# EAGLE design 612_jetracer_328_214 (EAGLE 9.6.2)
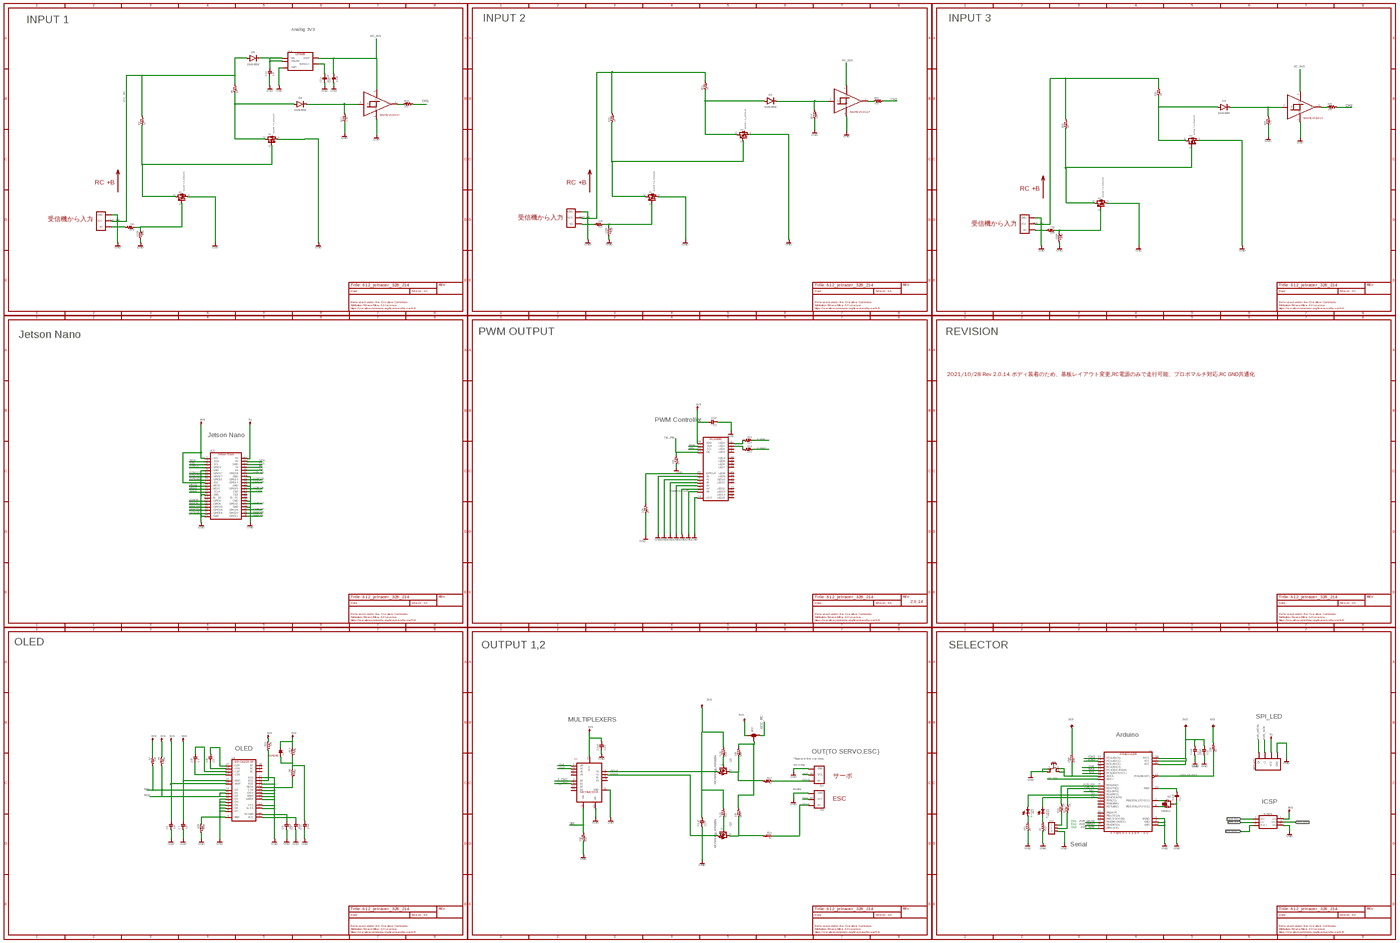
[diagram p0: schematic, sheet 1, overview]
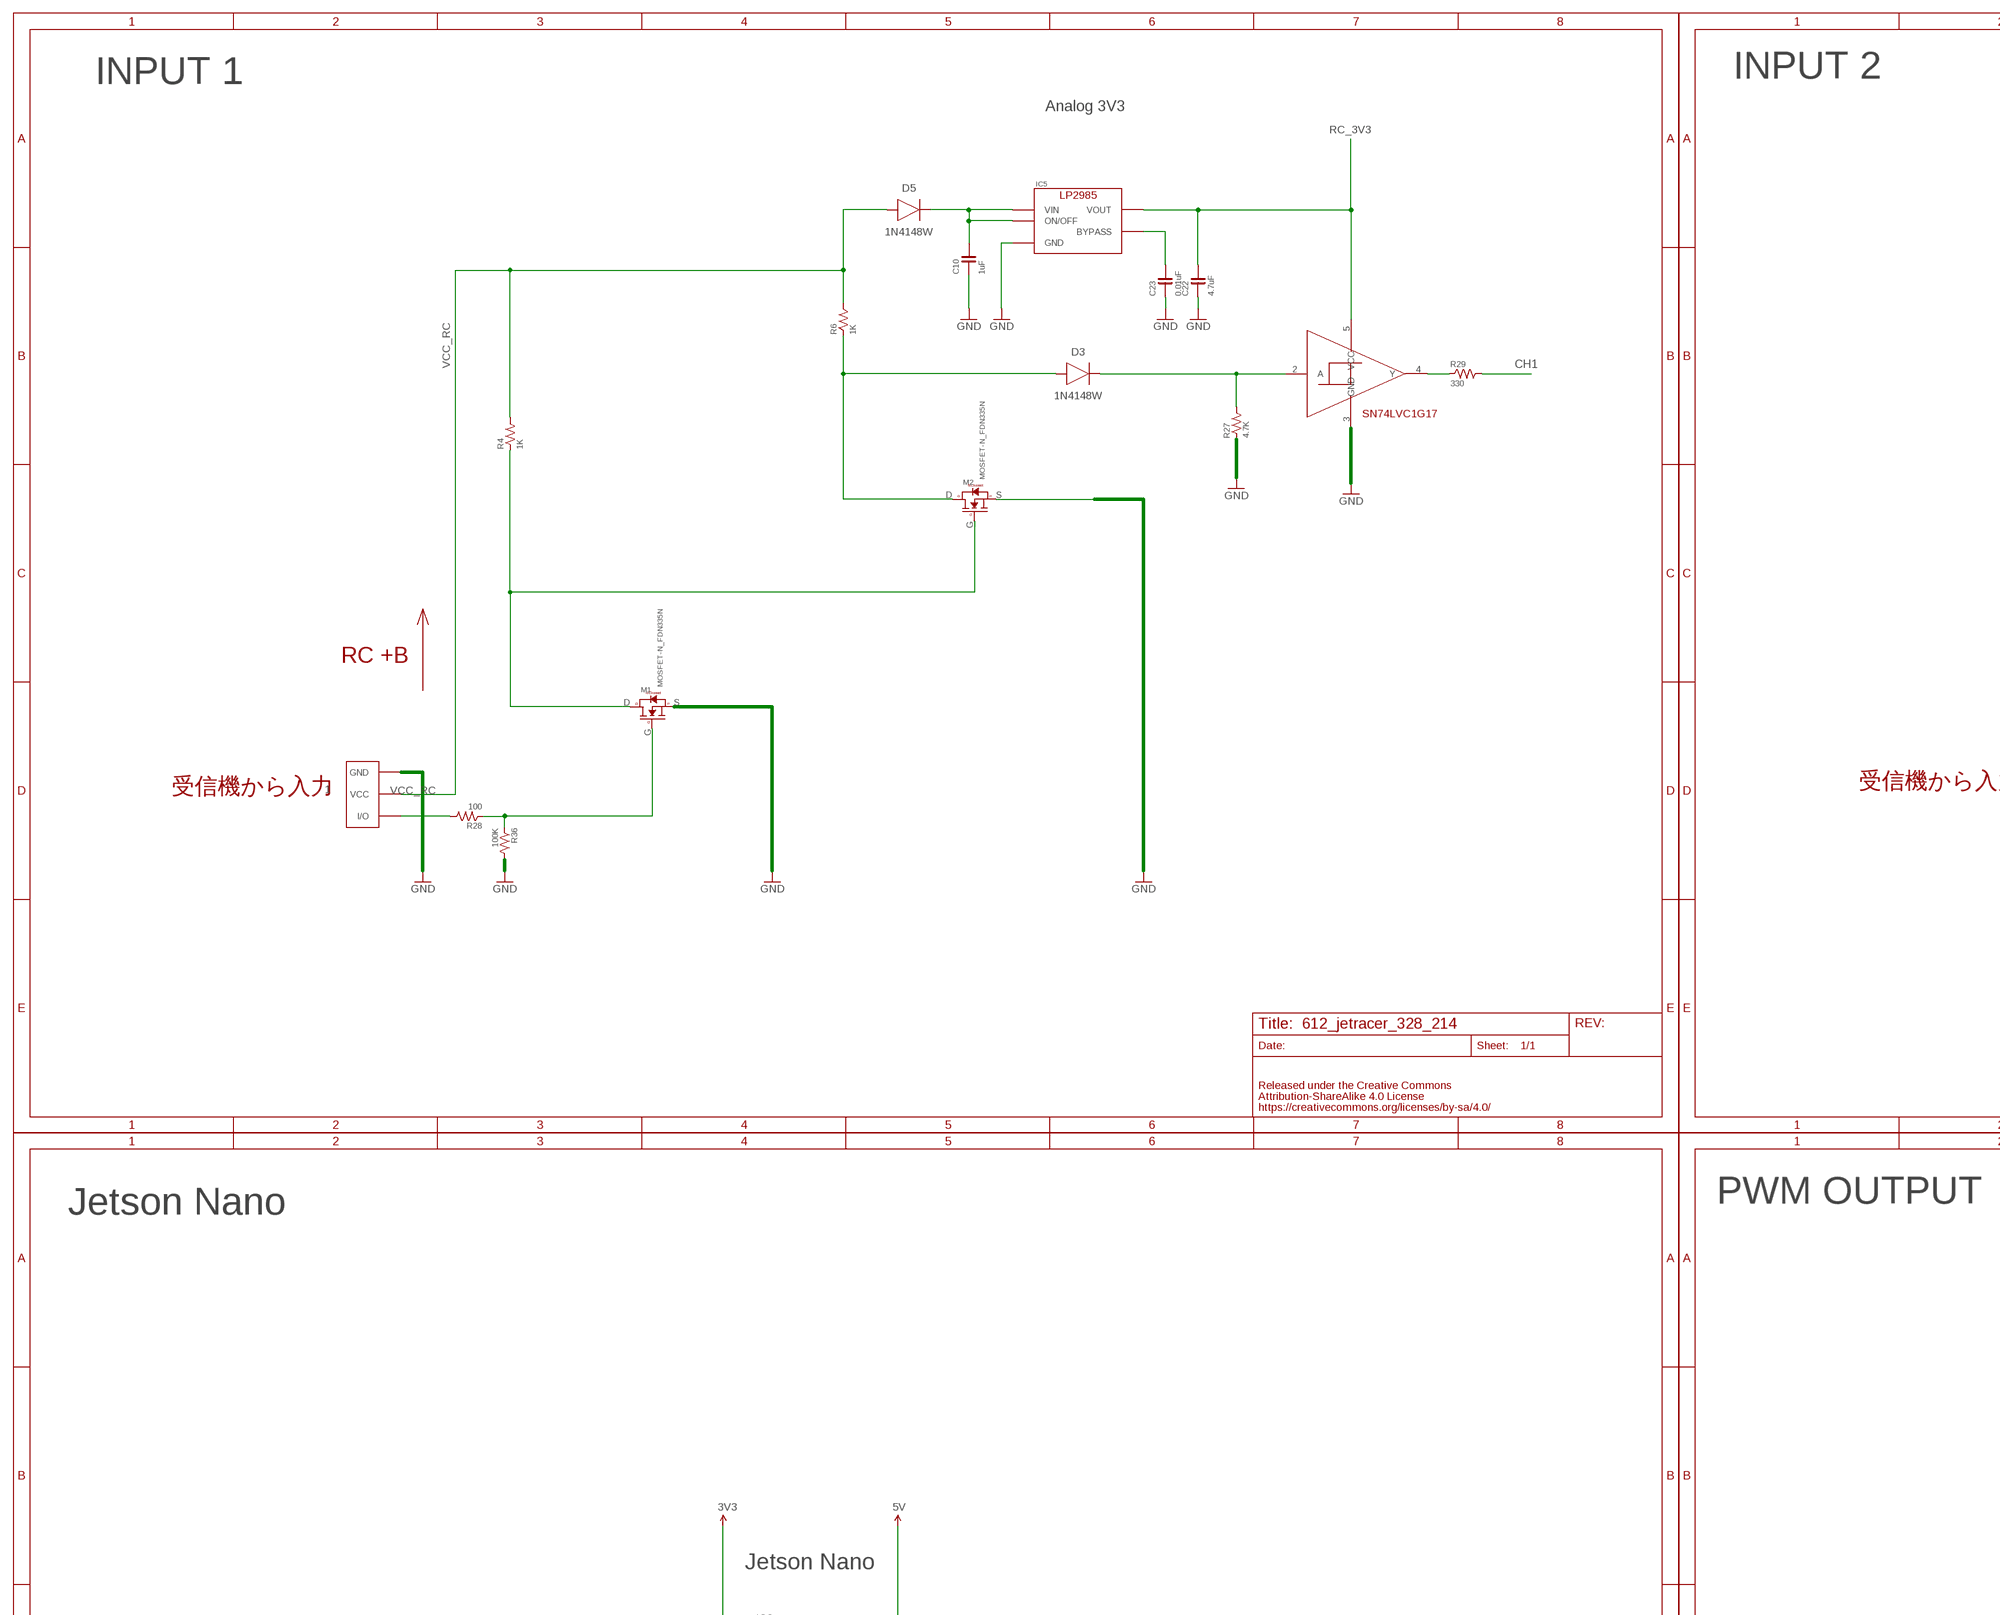
[diagram p1: schematic, sheet 1, part 1 of 6]
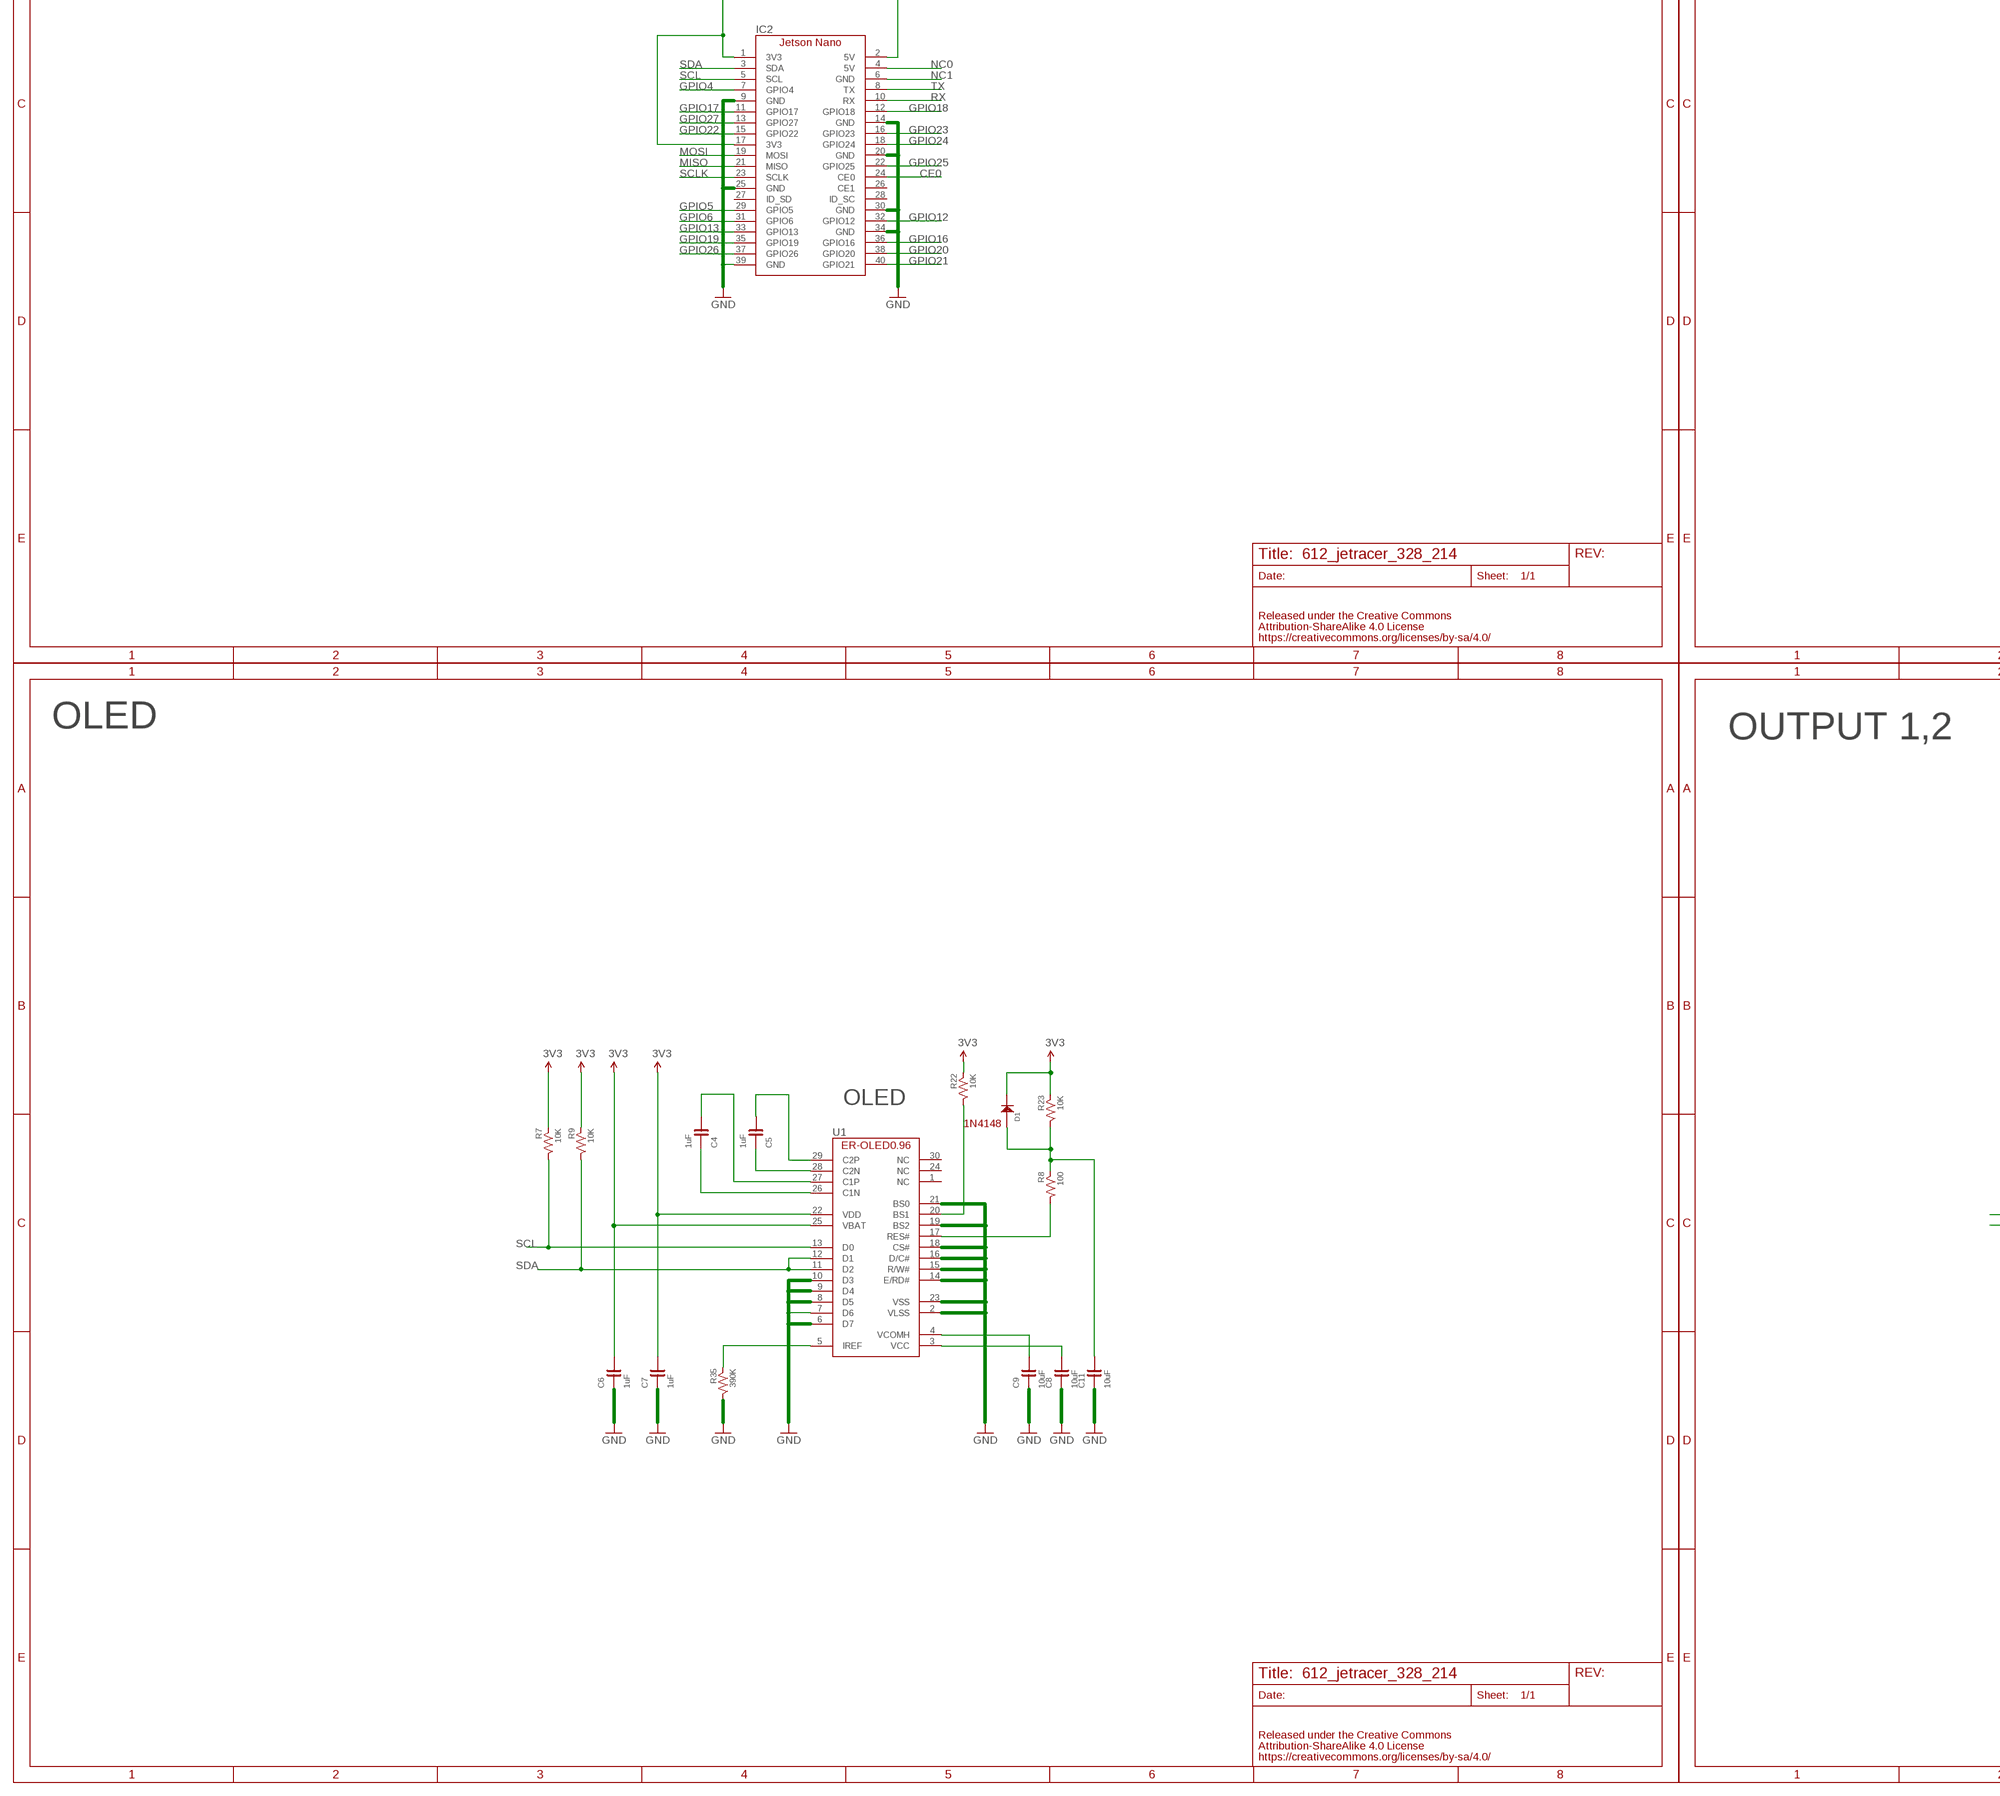
[diagram p2: schematic, sheet 1, part 2 of 6]
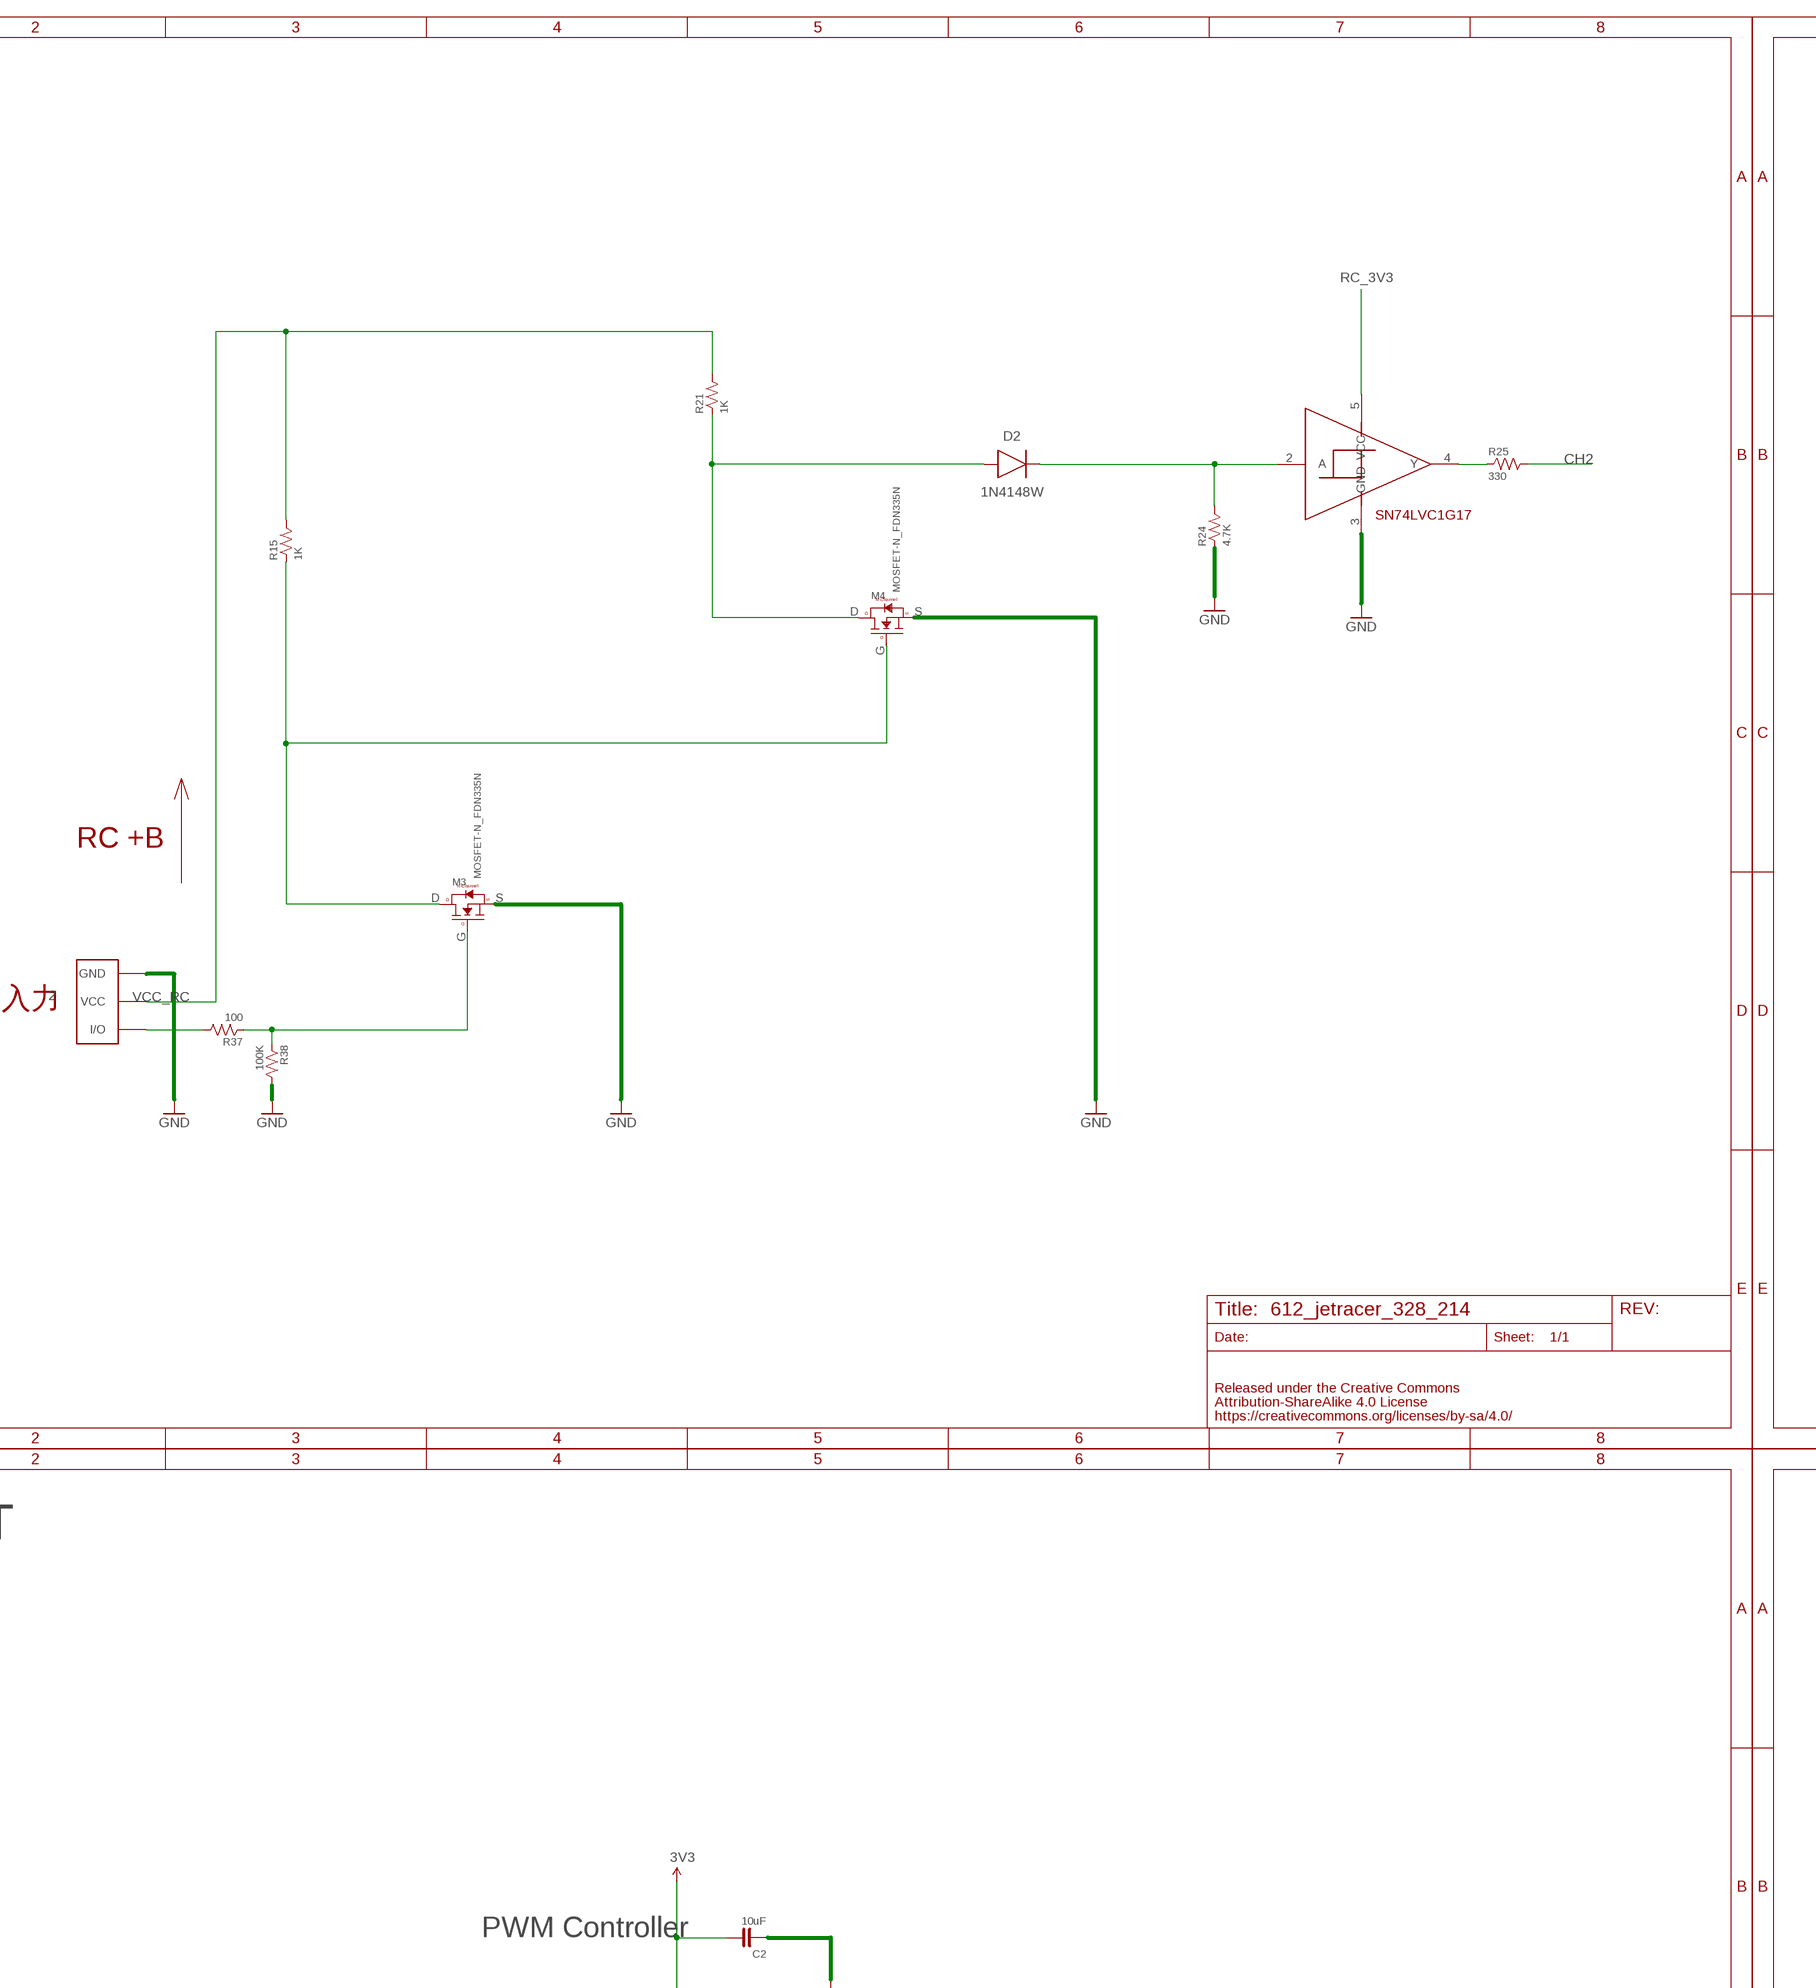
[diagram p3: schematic, sheet 1, part 3 of 6]
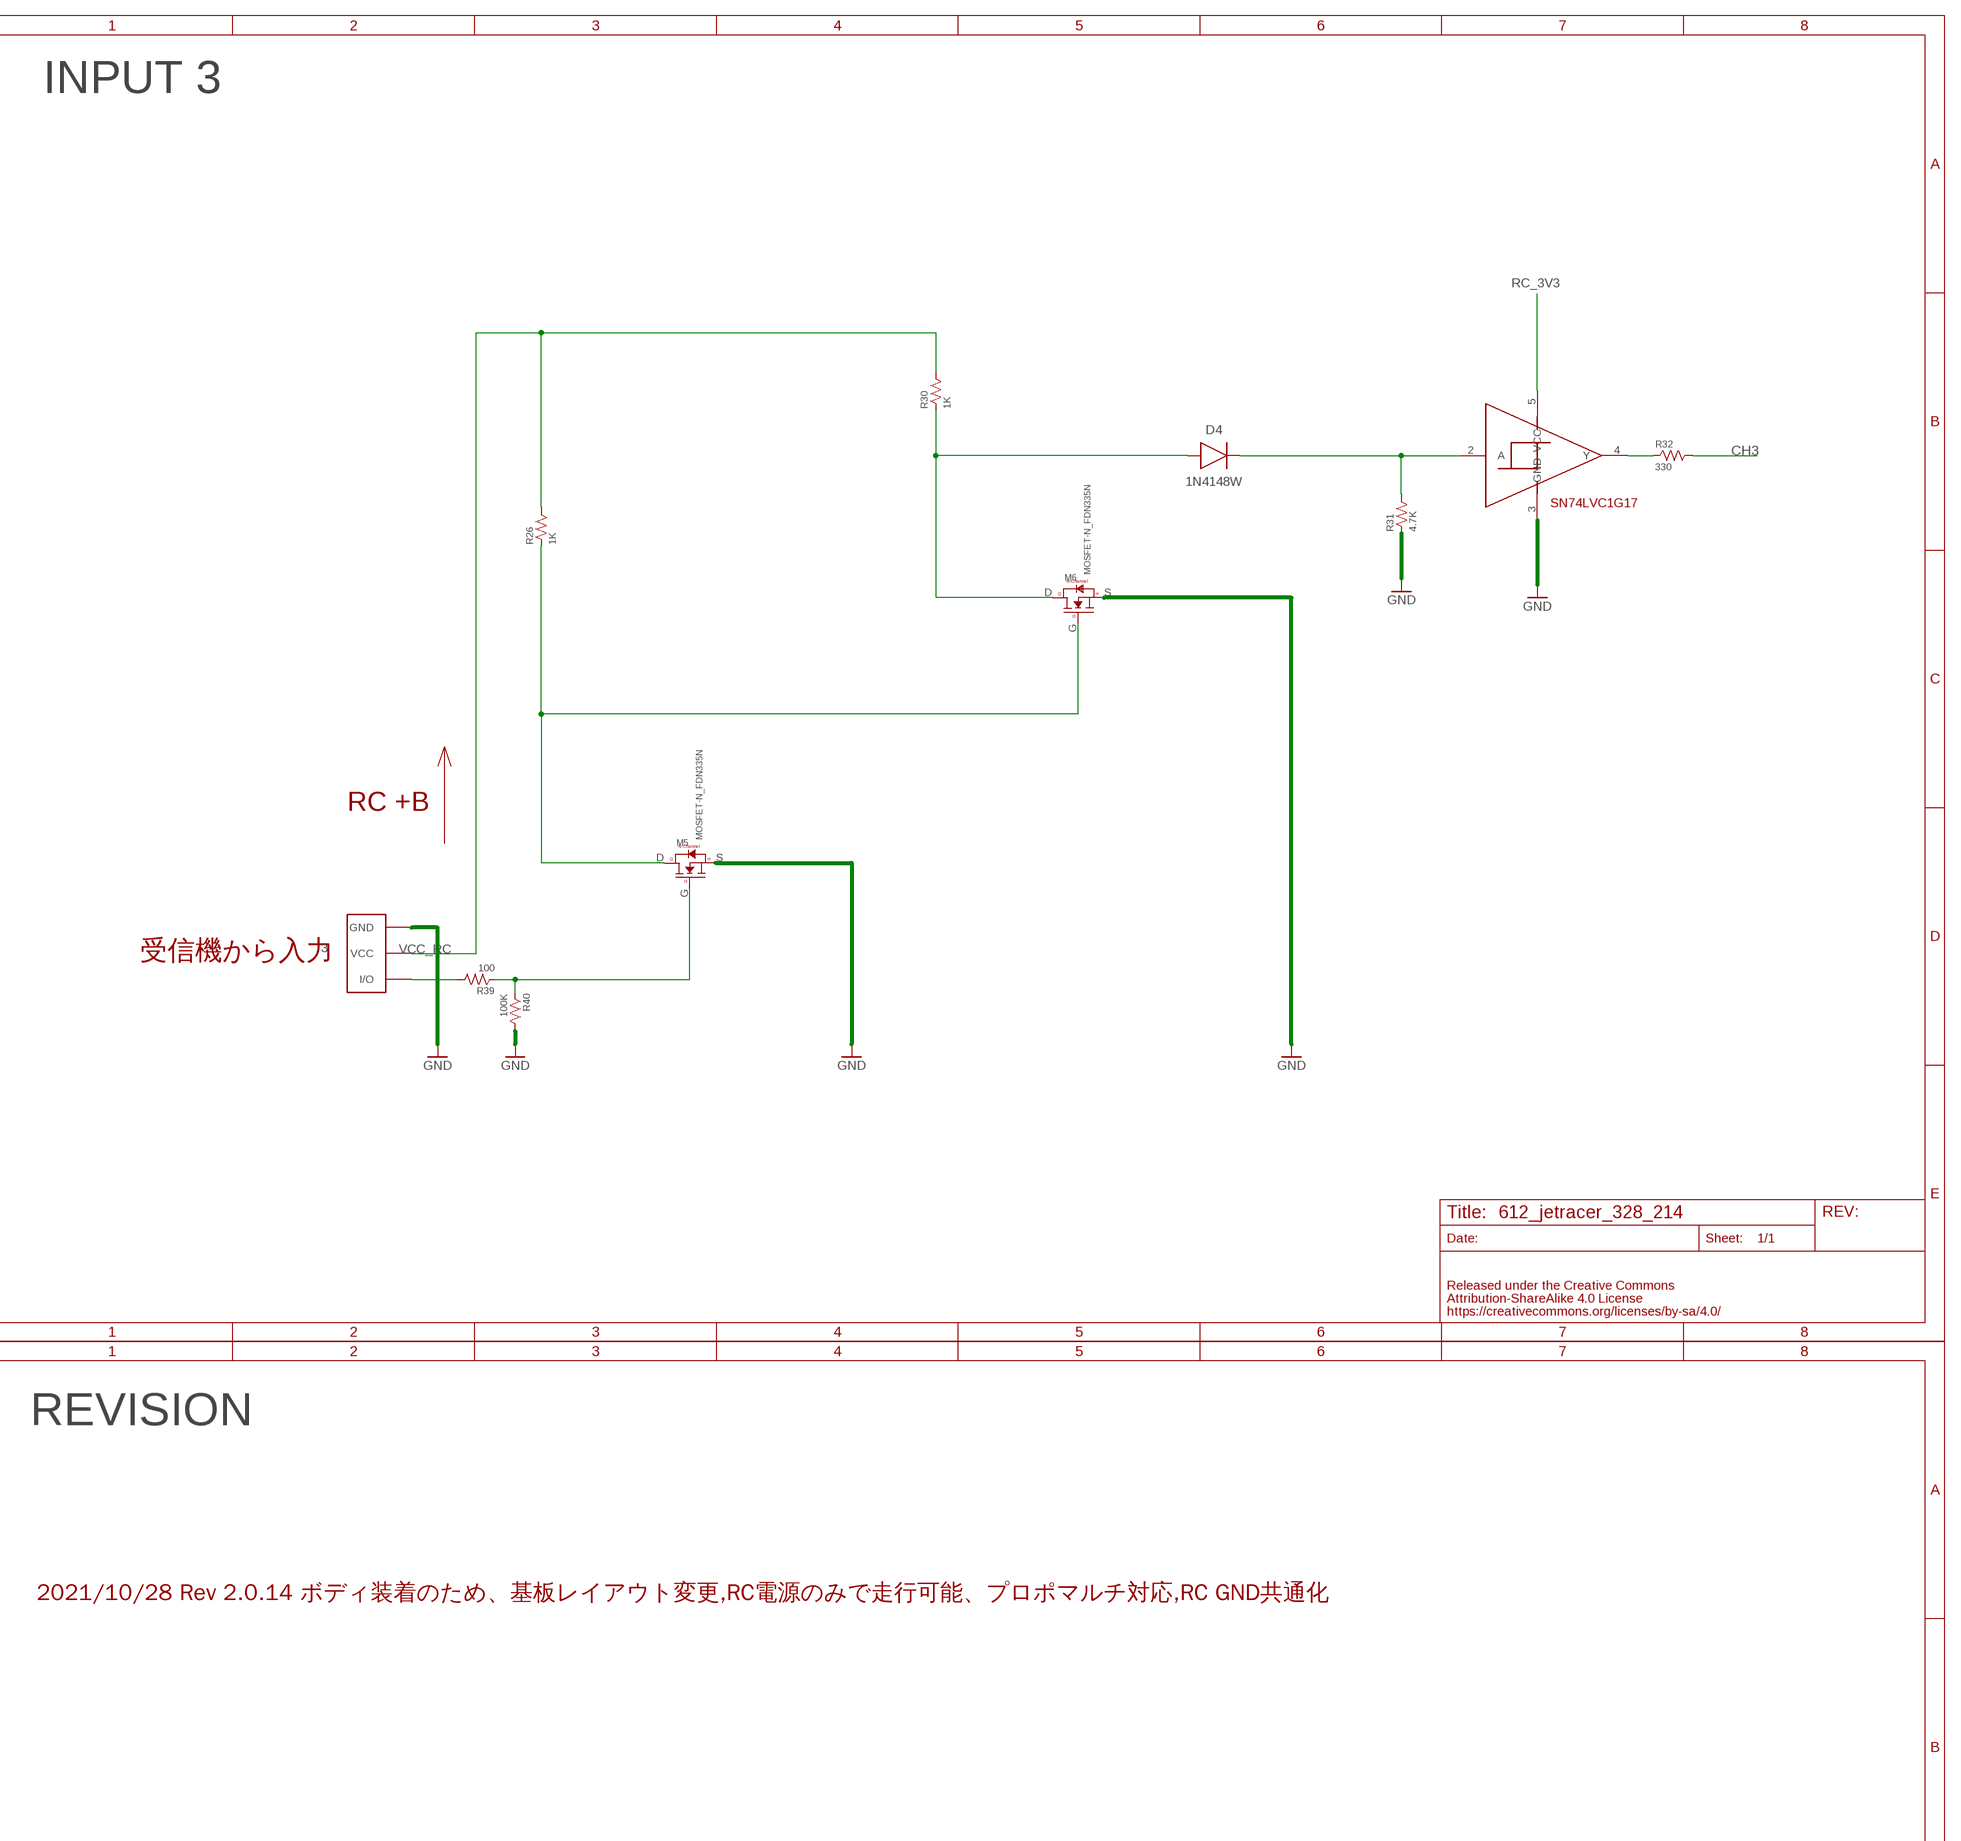
[diagram p4: schematic, sheet 1, part 4 of 6]
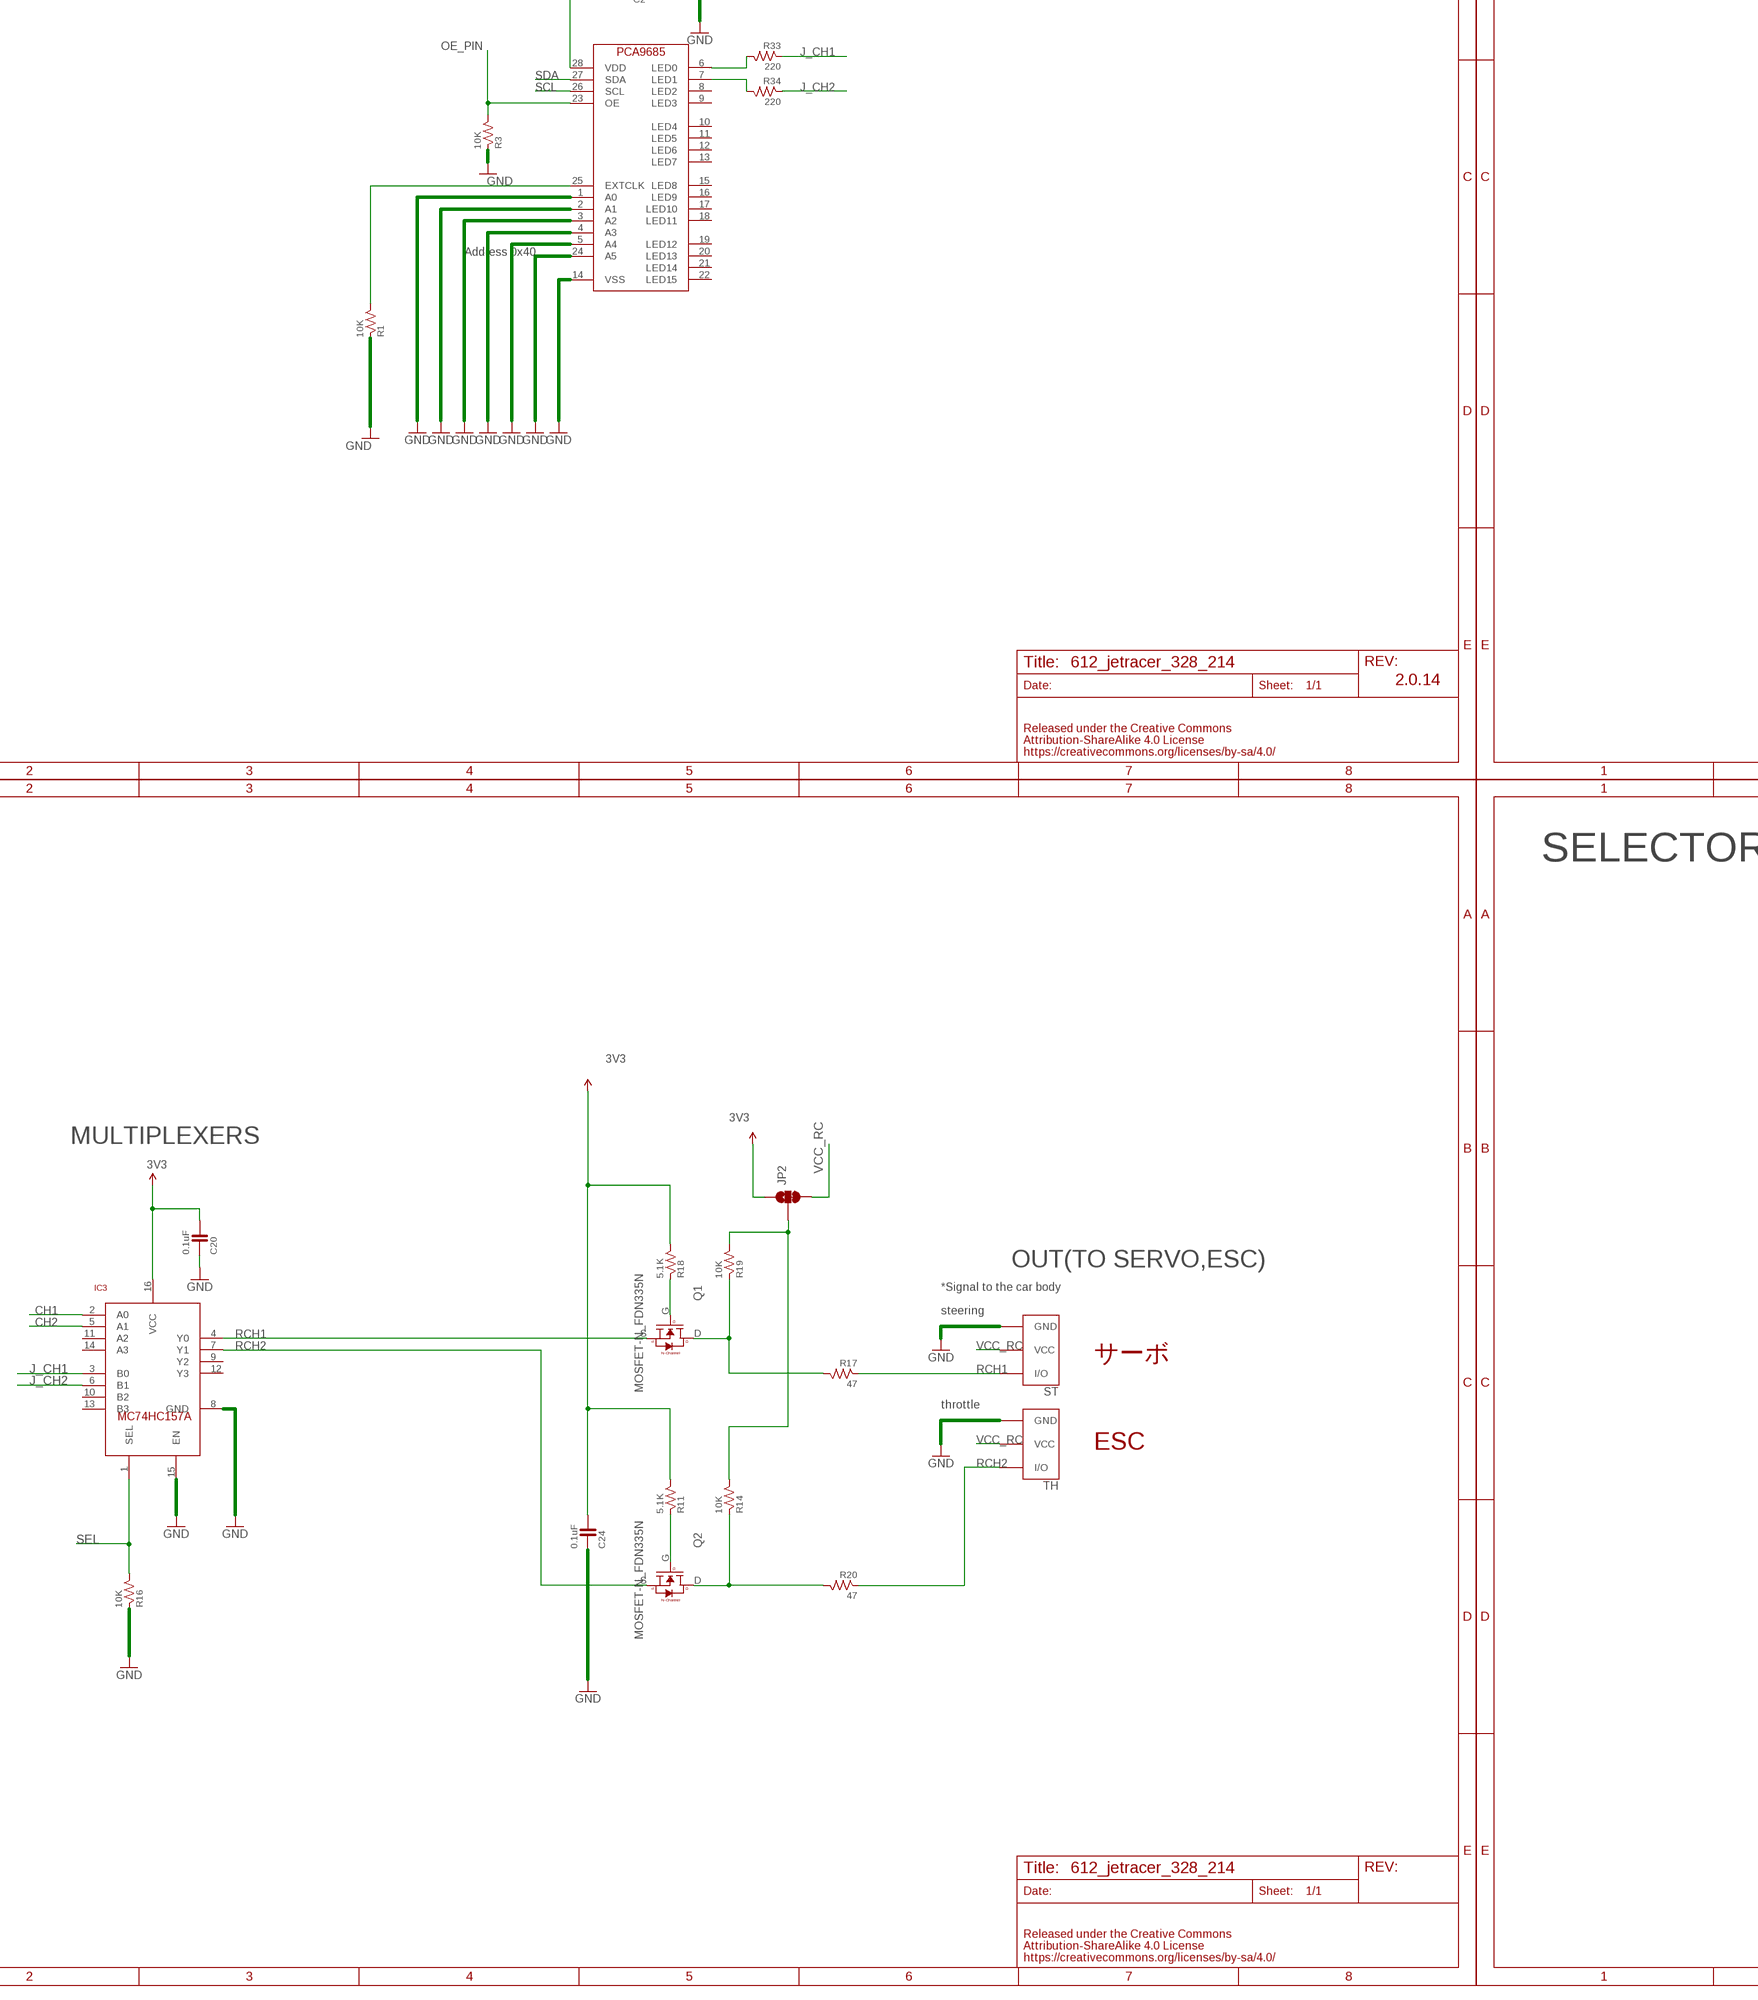
[diagram p5: schematic, sheet 1, part 5 of 6]
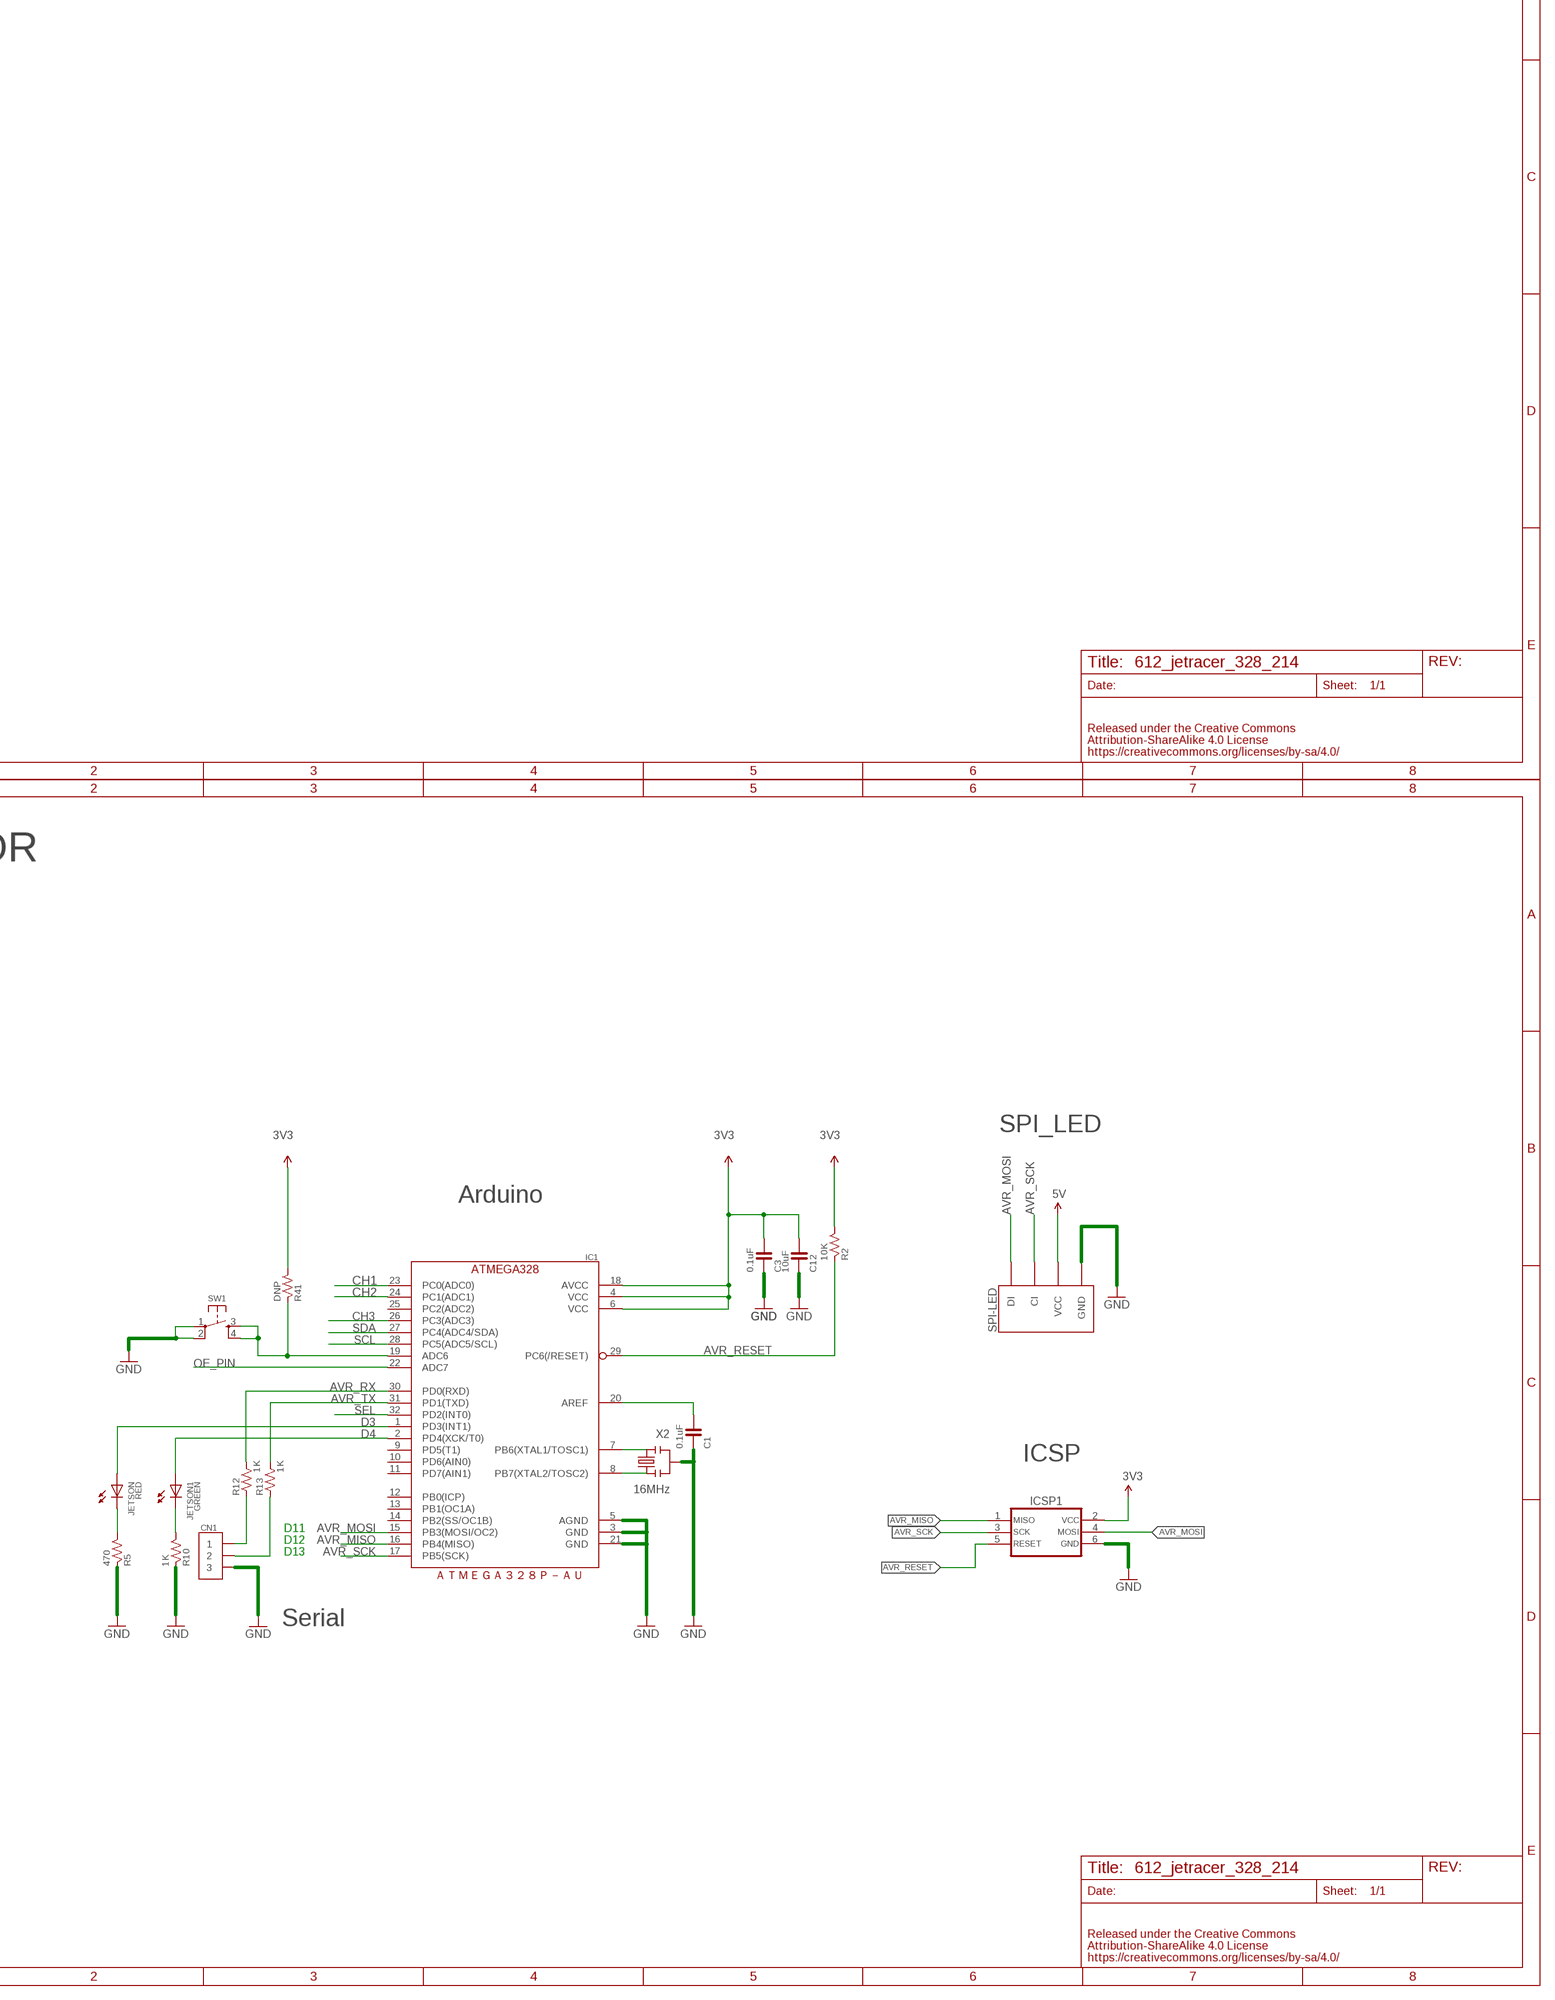
[diagram p6: schematic, sheet 1, part 6 of 6]

## Parts
1  FABO_BRICK_3PIN-HEADER  [FABO_BRICK_3PIN_HEADER]
2  FABO_BRICK_3PIN-HEADER  [FABO_BRICK_3PIN_HEADER]
3  FABO_BRICK_3PIN-HEADER  [FABO_BRICK_3PIN_HEADER]
C1  0.1uF  CAPACITOR-0603  [0603]
C2  10uF  CAPACITOR-0603  [0603]
C3  0.1uF  CAPACITOR-0603  [0603]
C4  1uF  CAPACITOR-0603  [0603]
C5  1uF  CAPACITOR-0603  [0603]
C6  1uF  CAPACITOR-0603  [0603]
C7  1uF  CAPACITOR-0603  [0603]
C8  10uF  CAPACITOR-0603  [0603]
C9  10uF  CAPACITOR-0603  [0603]
C10  1uF  CAPACITOR-0603  [0603]
C11  10uF  CAPACITOR-0603  [0603]
C12  10uF  CAPACITOR-0603  [0603]
C20  0.1uF  CAPACITOR-0603  [0603]
C22  4.7uF  CAPACITOR-0603  [0603]
C23  0.01uF  CAPACITOR-0603  [0603]
C24  0.1uF  CAPACITOR-0603  [0603]
CN1  PIN_1X3  [PIN_1X3]
D1  1N4148  [1N4148W]
D2  1N4148W  DIODE_1N4148W-7-F_SOD123G  [SOD3715X135]
D3  1N4148W  DIODE_1N4148W-7-F_SOD123G  [SOD3715X135]
D4  1N4148W  DIODE_1N4148W-7-F_SOD123G  [SOD3715X135]
D5  1N4148W  DIODE_1N4148W-7-F_SOD123G  [SOD3715X135]
IC1  ATMEGA328P-AU  [TQFP-32]
IC2  JETSON_NANO_NOBORDER  [JETSON_NANO_NOBOARDER]
IC3  MULTIPLEXERSMC74HC157A  [TSSOP-16]
IC4  PCA9685  [PCA9685]
IC5  LP2985-33DBV  [SOT-23-5]
ICSP1  ICSP_AVR-TC_NOHOLE  [TC2030]
JETSON  GREEN  LED-0603  [0603]
JETSON1  RED  LED-0603  [0603]
JP2  JUMPER-SMT_3_1-NC_TRACE_SILK  [SMT-JUMPER_3_1-NC_TRACE_SILK]
M1  MOSFET-N_FDN335N  [SUPERSOT-3]
M2  MOSFET-N_FDN335N  [SUPERSOT-3]
M3  MOSFET-N_FDN335N  [SUPERSOT-3]
M4  MOSFET-N_FDN335N  [SUPERSOT-3]
M5  MOSFET-N_FDN335N  [SUPERSOT-3]
M6  MOSFET-N_FDN335N  [SUPERSOT-3]
Q1  MOSFET-N_FDN335N  [SUPERSOT-3]
Q2  MOSFET-N_FDN335N  [SUPERSOT-3]
R1  10K  RESISTOR-0603  [0603]
R2  10K  RESISTOR-0603  [0603]
R3  10K  RESISTOR-0603  [0603]
R4  1K  RESISTOR-0603  [0603]
R5  470  RESISTOR-0603  [0603]
R6  1K  RESISTOR-0603  [0603]
R7  10K  RESISTOR-0603  [0603]
R8  100  RESISTOR-0603  [0603]
R9  10K  RESISTOR-0603  [0603]
R10  1K  RESISTOR-0603  [0603]
R11  5.1K  RESISTOR-0603  [0603]
R12  1K  RESISTOR-0603  [0603]
R13  1K  RESISTOR-0603  [0603]
R14  10K  RESISTOR-0603  [0603]
R15  1K  RESISTOR-0603  [0603]
R16  10K  RESISTOR-0603  [0603]
R17  47  RESISTOR-0603  [0603]
R18  5.1K  RESISTOR-0603  [0603]
R19  10K  RESISTOR-0603  [0603]
R20  47  RESISTOR-0603  [0603]
R21  1K  RESISTOR-0603  [0603]
R22  10K  RESISTOR-0603  [0603]
R23  10K  RESISTOR-0603  [0603]
R24  4.7K  RESISTOR-0603  [0603]
R25  330  RESISTOR-0603  [0603]
R26  1K  RESISTOR-0603  [0603]
R27  4.7K  RESISTOR-0603  [0603]
R28  100  RESISTOR-0603  [0603]
R29  330  RESISTOR-0603  [0603]
R30  1K  RESISTOR-0603  [0603]
R31  4.7K  RESISTOR-0603  [0603]
R32  330  RESISTOR-0603  [0603]
R33  220  RESISTOR-0603  [0603]
R34  220  RESISTOR-0603  [0603]
R35  390K  RESISTOR-0603  [0603]
R36  100K  RESISTOR-0603  [0603]
R37  100  RESISTOR-0603  [0603]
R38  100K  RESISTOR-0603  [0603]
R39  100  RESISTOR-0603  [0603]
R40  100K  RESISTOR-0603  [0603]
R41  DNP  RESISTOR-0603  [0603]
SPI-LED  FABO-SPI-LED-B04B  [SPI-B04B-PASK-1]
ST  FABO_BRICK_3PIN-HEADER  [FABO_BRICK_3PIN_HEADER]
SW1  TACT-SWITCH-SMD_KMR2  [KMR2]
TH  FABO_BRICK_3PIN-HEADER  [FABO_BRICK_3PIN_HEADER]
U1  ER-OLED0.96-1ER-CON30HT-1  [ER-CON30HT-1]
U$14  SN74LVC1G17  [SOT-23]
U$20  SN74LVC1G17  [SOT-23]
U$23  SN74LVC1G17  [SOT-23]
X2  16MHz  RESONATOR  [CSTNE_V_C]

## Nets
3V3: C2.2 C3.2 C6.2 C7.2 C12.2 C20.2 C24.2 D1.CATHODE IC1.4(VCC) IC1.6(VCC) IC1.18(AVCC) IC2.1(3V3) IC2.17(3V3) IC3.16(VCC) IC4.28(VDD) ICSP1.2 JP2.1 R2.2 R7.1 R9.1 R11.2 R18.2 R22.1 R23.1 R41.2 U1.22(VDD) U1.25(VBAT)
5V: IC2.2(5V) SPI-LED.VCC
AVR_MISO: IC1.16(PB4(MISO)) ICSP1.1
AVR_MOSI: IC1.15(PB3(MOSI/OC2)) ICSP1.4 SPI-LED.DI
AVR_RESET: IC1.29(PC6(/RESET)) ICSP1.5 R2.1
AVR_RX: IC1.30(PD0(RXD)) R12.2
AVR_SCK: IC1.17(PB5(SCK)) ICSP1.3 SPI-LED.CI
AVR_TX: IC1.31(PD1(TXD)) R13.2
CE0: IC2.24(CE0)
CH1: IC1.23(PC0(ADC0)) IC3.2(A0) R29.2
CH2: IC1.24(PC1(ADC1)) IC3.5(A1) R25.2
CH3: IC1.26(PC3(ADC3)) R32.2
D3: IC1.1(PD3(INT1)) JETSON1.ANODE
D4: IC1.2(PD4(XCK/T0)) JETSON.ANODE
GND: 1.GND 2.GND 3.GND C1.1 C2.1 C3.1 C6.1 C7.1 C8.1 C9.1 C10.1 C11.1 C12.1 C20.1 C22.1 C23.1 C24.1 CN1.3 IC1.3(GND) IC1.5(AGND) IC1.21(GND) IC2.9(GND) IC2.14(GND) IC2.20(GND) IC2.25(GND) IC2.30(GND) IC2.34(GND) IC2.39(GND) IC3.8(GND) IC3.15(EN) IC4.1(A0) IC4.2(A1) IC4.3(A2) IC4.4(A3) IC4.5(A4) IC4.14(VSS) IC4.24(A5) IC5.2(GND) ICSP1.6 M1.S M2.S M3.S M4.S M5.S M6.S R1.1 R3.1 R5.1 R10.1 R16.1 R24.1 R27.1 R31.1 R35.2 R36.2 R38.2 R40.2 SPI-LED.GND ST.GND SW1.1 SW1.2 TH.GND U1.2(VLSS) U1.6(D7) U1.7(D6) U1.8(D5) U1.9(D4) U1.10(D3) U1.14(E/RD#) U1.15(R/W#) U1.16(D/C#) U1.18(CS#) U1.19(BS2) U1.21(BS0) U1.23(VSS) U$14.3(GND) U$20.3(GND) U$23.3(GND) X2.2
GPIO4: IC2.7(GPIO4)
GPIO5: IC2.29(GPIO5)
GPIO6: IC2.31(GPIO6)
GPIO12: IC2.32(GPIO12)
GPIO13: IC2.33(GPIO13)
GPIO16: IC2.36(GPIO16)
GPIO17: IC2.11(GPIO17)
GPIO18: IC2.12(GPIO18)
GPIO19: IC2.35(GPIO19)
GPIO20: IC2.38(GPIO20)
GPIO21: IC2.40(GPIO21)
GPIO22: IC2.15(GPIO22)
GPIO23: IC2.16(GPIO23)
GPIO24: IC2.18(GPIO24)
GPIO25: IC2.22(GPIO25)
GPIO26: IC2.37(GPIO26)
GPIO27: IC2.13(GPIO27)
J_CH1: IC3.3(B0) R33.1
J_CH2: IC3.6(B1) R34.1
MISO: IC2.21(MISO)
MOSI: IC2.19(MOSI)
N$2: M1.G R28.1 R36.1
N$3: Q1.D R17.2 R19.1
N$4: C1.2 IC1.20(AREF)
N$5: IC1.8(PB7(XTAL2/TOSC2)) X2.3
N$6: CN1.1 R12.1
N$7: IC1.19(ADC6) R41.1 SW1.3 SW1.4
N$8: IC4.25(EXTCLK) R1.2
N$9: Q2.D R14.1 R20.2
N$10: R17.1 ST.I/O
N$11: M1.D M2.G R4.1
N$12: D3.2(A) M2.D R6.1
N$13: 2.I/O R37.2
N$14: R20.1 TH.I/O
N$15: IC1.7(PB6(XTAL1/TOSC1)) X2.1
N$16: C4.2 U1.27(C1P)
N$17: CN1.2 R13.1
N$18: M3.D M4.G R15.1
N$19: JETSON1.CATHODE R5.2
N$20: JETSON.CATHODE R10.2
N$21: C4.1 U1.26(C1N)
N$22: C5.1 U1.28(C2N)
N$23: C5.2 U1.29(C2P)
N$24: R35.1 U1.5(IREF)
N$25: C9.2 U1.4(VCOMH)
N$26: C8.2 U1.3(VCC)
N$27: R8.2 U1.17(RES#)
N$28: C11.2 D1.ANODE R8.1 R23.2
N$29: D2.2(A) M4.D R21.1
N$30: D2.1(C) R24.2 U$20.2(A)
N$31: R25.1 U$20.4(Y)
N$32: 3.I/O R39.2
N$33: M5.D M6.G R26.1
N$34: D3.1(C) R27.2 U$14.2(A)
N$35: R29.1 U$14.4(Y)
N$36: D4.2(A) M6.D R30.1
N$37: D4.1(C) R31.2 U$23.2(A)
N$38: R32.1 U$23.4(Y)
N$39: Q2.G R11.1
N$40: Q1.G R18.1
N$41: JP2.2 R14.2 R19.2
N$42: IC4.6(LED0) R33.2
N$43: IC4.7(LED1) R34.2
N$44: 1.I/O R28.2
N$45: M3.G R37.1 R38.1
N$46: M5.G R39.1 R40.1
N$47: C23.2 IC5.4(BYPASS)
N$48: C10.2 D5.1(C) IC5.1(VIN) IC5.3(ON/OFF)
N$50: R22.2 U1.20(BS1)
NC0: IC2.4(5V)
NC1: IC2.6(GND)
OE_PIN: IC1.22(ADC7) IC4.23(OE) R3.2
RC_3V3: C22.2 IC5.5(VOUT) U$14.5(VCC) U$20.5(VCC) U$23.5(VCC)
RCH1: IC3.4(Y0) Q1.S
RCH2: IC3.7(Y1) Q2.S
RX: IC2.10(RX)
SCL: IC1.28(PC5(ADC5/SCL)) IC2.5(SCL) IC4.26(SCL) R7.2 U1.13(D0)
SCLK: IC2.23(SCLK)
SDA: IC1.27(PC4(ADC4/SDA)) IC2.3(SDA) IC4.27(SDA) R9.2 U1.11(D2) U1.12(D1)
SEL: IC1.32(PD2(INT0)) IC3.1(SEL) R16.2
TX: IC2.8(TX)
VCC_RC: 1.VCC 2.VCC 3.VCC D5.2(A) JP2.3 R4.2 R6.2 R15.2 R21.2 R26.2 R30.2 ST.VCC TH.VCC
Unconnected: IC1.9(PD5(T1)) IC1.10(PD6(AIN0)) IC1.11(PD7(AIN1)) IC1.12(PB0(ICP)) IC1.13(PB1(OC1A)) IC1.14(PB2(SS/OC1B)) IC1.25(PC2(ADC2)) IC2.26(CE1) IC2.27(ID_SD) IC2.28(ID_SC) IC3.9(Y2) IC3.10(B2) IC3.11(A2) IC3.12(Y3) IC3.13(B3) IC3.14(A3) IC4.8(LED2) IC4.9(LED3) IC4.10(LED4) IC4.11(LED5) IC4.12(LED6) IC4.13(LED7) IC4.15(LED8) IC4.16(LED9) IC4.17(LED10) IC4.18(LED11) IC4.19(LED12) IC4.20(LED13) IC4.21(LED14) IC4.22(LED15) U1.1(NC) U1.24(NC) U1.30(NC)

## Notes on the sheet
- INPUT 1 | INPUT 2 | INPUT 3
- Analog 3V3
- SN74LVC1G17
- SN74LVC1G17
- SN74LVC1G17
- RC +B | RC +B
- RC +B
- 受信機から入力 | 受信機から入力
- 受信機から入力
- Jetson Nano | PWM OUTPUT | REVISION
- 2021/10/28 Rev 2.0.14 ボディ装着のため、基板レイアウト変更,RC電源のみで走行可能、プロポマルチ対応,RC GND共通化
- PWM Controller
- Jetson Nano
- Address 0x40
- 2.0.14
- OLED | OUTPUT 1,2 | SELECTOR
- SPI_LED
- MULTIPLEXERS
- Arduino
- OLED
- OUT(TO SERVO,ESC)
- 1N4148
- *Signal to the car body
- steering
- サーボ
- throttle
- MC74HC157A
- ESC
- ICSP
- D11
- D12
- D13
- ＡＴＭＥＧＡ３２８Ｐ－ＡＵ
- Serial

## Library data of the parts
1-3 ST TH = FaBo-Template:FABO_BRICK_3PIN: FaBo Brick 3pin
C1-C12 C20 C22 C23 = FaBo-Capacitor:CAPACITOR: CAPACITOR
C24 = FaBo-Capacitor:CAPACITOR: CAPACITOR; SPICEPREFIX: C
CN1 = FaBo-PIN:PIN_1X3
D1 = FaBo-Diode:1N4148
D2-D5 = Diode:DIODE_: Diode Rectifier - Popular parts; CATEGORY: Diode; DESCRIPTION: DIODE GEN PURP 100V 300MA SOD123; MANUFACTURER: Diodes Incorporated; SUB-CATEGORY: Rectifier
IC1 = component:ATMEGA328
IC2 = FaBo-Boards:JETSON_NANO
IC3 = FaBo-Multiplexers:MULTIPLEXERS
IC4 = FaBo-Motor:PCA9685
IC5 = FaBo-Supply:LP2985: LP2985
ICSP1 = component:ICSP_AVR
JETSON JETSON1 = FaBo-LED:LED
JP2 = SparkFun-Jumpers:JUMPER-SMT_3_1-NC_TRACE: Normally closed trace jumper (1 of 2 connections) This jumper has a trace between two pads so it's normally closed (NC). The other connection is normally open (NO). Use a razor knife to open the connection. For best results follow the IPC guidelines for cutting traces: Cutout at least 0.063 mm (0.005 in). Remove all loose material to clean up the cut area. Seal the cut with an approved epoxy. Reapply solder to reclose the connection, or to close the NO connection.
M1-M6 Q1 Q2 = FaBo-Mosfet:MOSFET-N
R1-R41 = FaBo-Resistors:RESISTOR: RESISTOR
SPI-LED = FaBo-Connetor:FABO-SPI-LED
SW1 = FaBo-Switch:TACT-SWITCH: Part No Maker Datasheet Distributor 1273HA-160G-G SWITRONIC Catalog <http://www.switronic.com/uploads/images/A10.gif> Akizuki <http://akizukidenshi.com/catalog/g/gP-02561/> DTS-6-V Cosland DTS 6 Series <http://www.cosland.com/newproduct/DTS%20SERIES.pdf> Akizuki <http://akizukidenshi.com/catalog/g/gP-03647/> KMR2 C&K KMR2 SERIES <https://www.ckswitches.com/products/switches/product-details/Tactile/KMR2/> Octoparts Result <https://octopart.com/search?q=KMR2&start=0> TSHA-T-XB2-19E TOP UP INDUSTORY TSHA-T <http://www.top-up.com.tw/front/bin/ptdetail.phtml?Part=TSHA-T> Akizuki <http://akizukidenshi.com/catalog/g/gP-09361/>
U1 = FaBo-Display:ER-OLED0.96-1
U$14 U$20 U$23 = FaBo-LogicIC:SN74LVC1G17
X2 = component:RESONATOR

## Board
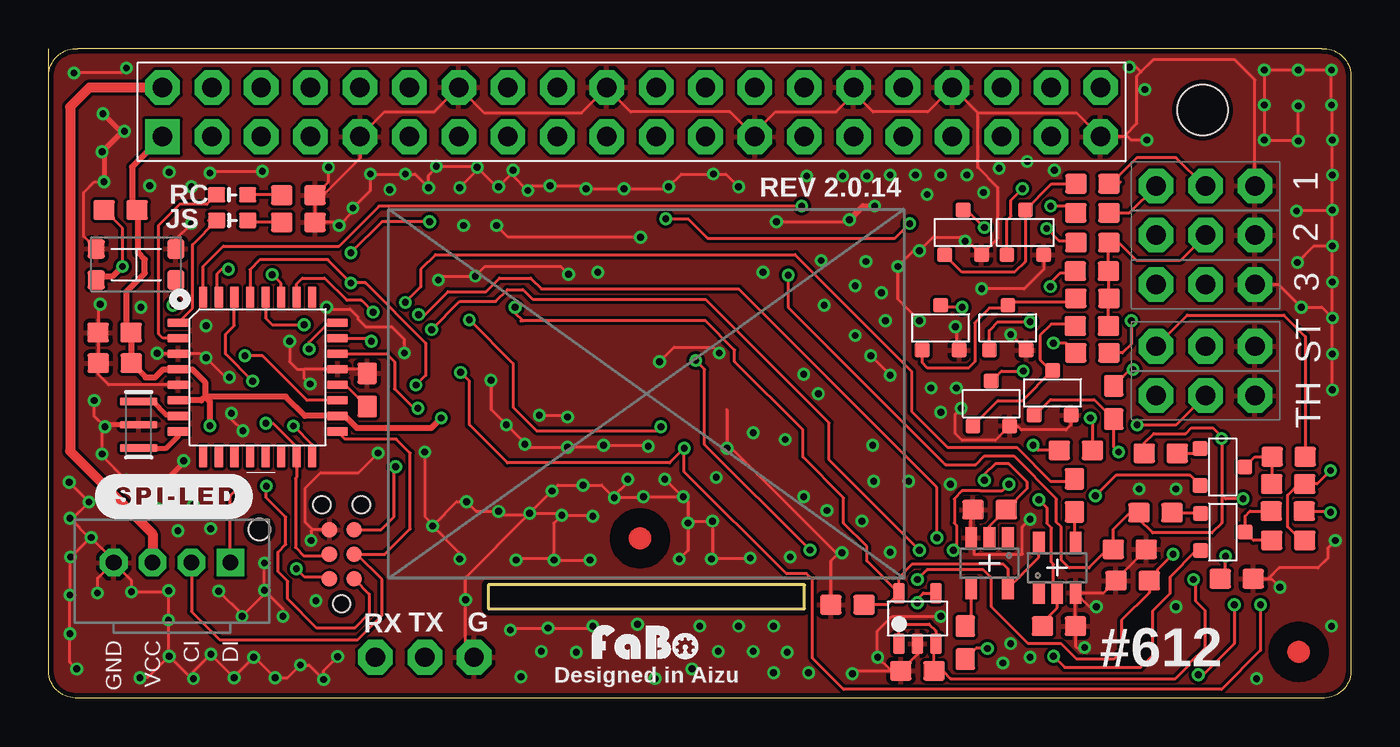
[diagram p7: board, top side]
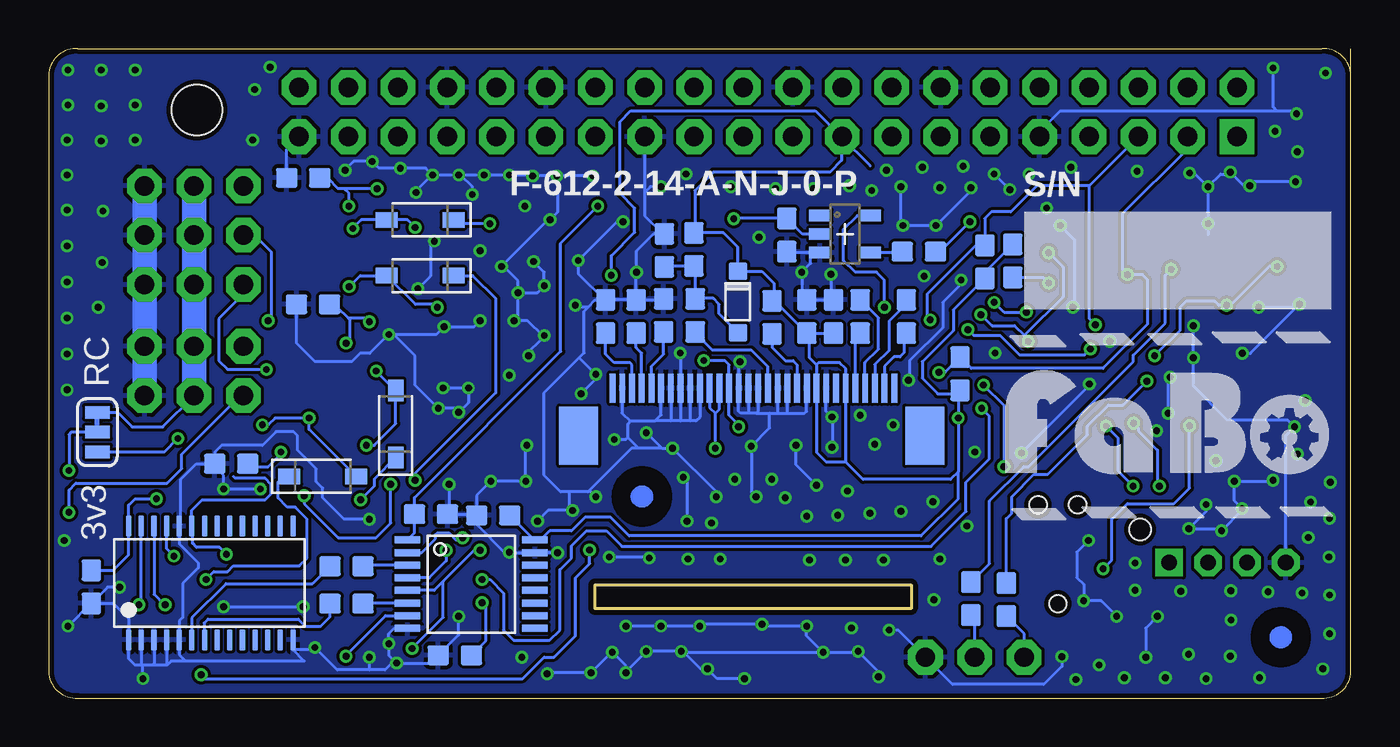
[diagram p8: board, bottom side, seen from below]

Size 67 x 33.4 mm. Coordinates in mm from the lower left corner, seen from the top.
Outline: 0,31.9 0,33.4
Outline: 0,31.9 arc-97 1.5,33.4 65.5,33.4 arc-97 67,31.9 67,1.5 arc-97 65.5,0 1.5,0 arc-97 0,1.5 0,31.9
Outline: 22.61,4.6 38.89,4.6 38.89,5.83 22.61,5.83 22.61,4.6
Copper layers (1*16): Top 0.035mm / dielectric 1.6mm / Bottom 0.035mm
Design rules "PCBway": minimum track width 6mil, minimum drill 12mil, track to track 6mil, track to pad 6mil, pad to pad 6mil, via to via 6mil, smd to smd 6mil, copper to edge 10mil, drill to drill 10mil, minimum pad ring 10mil, minimum via ring 6mil, stop-mask expansion 2mil, vias tented up to drill 100mil, thermal gap 8mil
Holes 2.6 mm at 59.38,30.25
tKeepout: area 17.4,6 to 44.2,25.2
bKeepout: area 3,11.9 to 7,15.6
bRestrict: 7 lines

### Footprints (pad centres in the part's own frame; a part is rotated, then mirrored left to right if it is on the bottom)
FABO_BRICK_3PIN_HEADER = drill 1 pad 1.778 octagon: GND -2.54,0; I/O 2.54,0; VCC 0,0
0603 = smd 1.1 x 1: 1 -0.85,0; 2 0.85,0
PIN_1X3 = drill 1 pad 1.778 octagon: 1 -2.54,0; 2 0,0; 3 2.54,0
1N4148W = smd 0.9 x 0.95: ANODE 0,0; CATHODE 3.15,0
SOD3715X135 = smd 1.127 x 0.784: 1 -1.722,0; 2 1.722,0
TQFP-32 = smd 1.1 x 0.45: 1 -4.1,2.8; 2 -4.1,2; 3 -4.1,1.2; 4 -4.1,0.4; 5 -4.1,-0.4; 6 -4.1,-1.2; 7 -4.1,-2; 8 -4.1,-2.8; 17 4.1,-2.8; 18 4.1,-2; 19 4.1,-1.2; 20 4.1,-0.4; 21 4.1,0.4; 22 4.1,1.2; 23 4.1,2; 24 4.1,2.8 | smd 0.45 x 1.1: 9 -2.8,-4.1; 10 -2,-4.1; 11 -1.2,-4.1; 12 -0.4,-4.1; 13 0.4,-4.1; 14 1.2,-4.1; 15 2,-4.1; 16 2.8,-4.1; 25 2.8,4.1; 26 2,4.1; 27 1.2,4.1; 28 0.4,4.1; 29 -0.4,4.1; 30 -1.2,4.1; 31 -2,4.1; 32 -2.8,4.1
JETSON_NANO_NOBOARDER = drill 1 pad 1.778 square: 1 1.27,1.27 | drill 1 pad 1.778 octagon: 2 1.27,3.81; 3 3.81,1.27; 4 3.81,3.81; 5 6.35,1.27; 6 6.35,3.81; 7 8.89,1.27; 8 8.89,3.81; 9 11.43,1.27; 10 11.43,3.81; 11 13.97,1.27; 12 13.97,3.81; 13 16.51,1.27; 14 16.51,3.81; 15 19.05,1.27; 16 19.05,3.81; 17 21.59,1.27; 18 21.59,3.81; 19 24.13,1.27; 20 24.13,3.81; 21 26.67,1.27; 22 26.67,3.81; 23 29.21,1.27; 24 29.21,3.81; 25 31.75,1.27; 26 31.75,3.81; 27 34.29,1.27; 28 34.29,3.81; 29 36.83,1.27; 30 36.83,3.81; 31 39.37,1.27; 32 39.37,3.81; 33 41.91,1.27; 34 41.91,3.81; 35 44.45,1.27; 36 44.45,3.81; 37 46.99,1.27; 38 46.99,3.81; 39 49.53,1.27; 40 49.53,3.81
TSSOP-16 = smd 0.36 x 1.3: 1 -2.275,-3.28; 2 -1.625,-3.28; 3 -0.975,-3.28; 4 -0.325,-3.28; 5 0.325,-3.28; 6 0.975,-3.28; 7 1.625,-3.28; 8 2.275,-3.28; 9 2.275,3.28; 10 1.625,3.28; 11 0.975,3.28; 12 0.325,3.28; 13 -0.325,3.28; 14 -0.975,3.28; 15 -1.625,3.28; 16 -2.275,3.28
PCA9685 = smd 0.3 x 1.1: 1 -4.15,-2.93; 2 -3.5,-2.93; 3 -2.85,-2.93; 4 -2.2,-2.93; 5 -1.55,-2.93; 6 -0.9,-2.93; 7 -0.25,-2.93; 8 0.4,-2.93; 9 1.05,-2.93; 10 1.7,-2.93; 11 2.35,-2.93; 12 3,-2.93; 13 3.65,-2.93; 14 4.3,-2.93; 15 4.3,2.92; 16 3.65,2.92; 17 3,2.92; 18 2.35,2.92; 19 1.7,2.92; 20 1.05,2.92; 21 0.4,2.92; 22 -0.25,2.92; 23 -0.9,2.92; 24 -1.55,2.92; 25 -2.2,2.92; 26 -2.85,2.92; 27 -3.5,2.92; 28 -4.15,2.92
SOT-23-5 = smd 0.6 x 1.05: 1 -0.95,-1.3; 2 0,-1.3; 3 0.95,-1.3; 4 0.95,1.3; 5 -0.95,1.3
TC2030 = smd 0.787 x 0.787: 1 1.27,-0.635; 2 1.27,0.635; 3 2.54,-0.635; 4 2.54,0.635; 5 3.81,-0.635; 6 3.81,0.635 | hole 0.889: 0,0; 5.08,-1.016; 5.08,1.016
0603' = smd 0.9 x 0.8: ANODE -0.8,0; CATHODE 0.8,0
SMT-JUMPER_3_1-NC_TRACE_SILK = smd 0.635 x 1.27: 1 -1.016,0; 2 0,0; 3 1.016,0
SUPERSOT-3 = smd 0.76 x 0.76: D 0,1.15; G -0.95,-1.15; S 0.95,-1.15
SPI-B04B-PASK-1 = drill 0.8 pad 1.422 octagon: CI 1,1.27; GND -3,1.27; VCC -1,1.27 | drill 0.8 pad 1.422 square: DI 3,1.27 | hole 1.1: 4.5,2.97
KMR2 = smd 0.9 x 1: 1 -2.05,0.8; 2 2.05,0.8; 3 2.05,-0.8; 4 -2.05,-0.8
ER-CON30HT-1 = smd 0.3 x 1.5 bottom: 1 7,-0.23; 2 6.5,-0.23; 3 6,-0.23; 4 5.5,-0.23; 5 5,-0.23; 6 4.5,-0.23; 7 4,-0.23; 8 3.5,-0.23; 9 3,-0.23; 10 2.5,-0.23; 11 2,-0.23; 12 1.5,-0.23; 13 1,-0.23; 14 0.5,-0.23; 15 0,-0.23; 16 -0.5,-0.23; 17 -1,-0.23; 18 -1.5,-0.23; 19 -2,-0.23; 20 -2.5,-0.23; 21 -3,-0.23; 22 -3.5,-0.23; 23 -4,-0.23; 24 -4.5,-0.23; 25 -5,-0.23; 26 -5.5,-0.23; 27 -6,-0.23; 28 -6.5,-0.23; 29 -7,-0.23; 30 -7.5,-0.23 | smd 2 x 3 bottom: 31 -9.07,-2.67; 32 8.74,-2.67
SOT-23 = smd 1.1 x 0.6: 1 -1.3,0.95; 2 -1.3,0; 3 -1.3,-0.95; 4 1.3,-0.95; 5 1.3,0.95
CSTNE_V_C = smd 0.4 x 1.9: 1 1.2,0; 2 0,0; 3 -1.2,0

### Placement (x,y rotation side)
1  59.52,26.35 180 top
2  59.52,23.81 180 top
3  59.52,21.27 180 top
C1  16.39,15.85 270 top
C2  64.81,5.72 90 bottom
C3  3.41,17.22 0 top
C4  25.25,19.63 90 bottom
C5  22.87,19.63 270 bottom
C6  28,19.63 270 bottom
C7  26.62,19.63 270 bottom
C8  38.35,19.63 270 bottom
C9  36.77,19.63 270 bottom
C10  44.7,1.4 0 top
C11  35.32,23.03 270 bottom
C12  3.39,18.8 0 top
C20  44.13,9.4 0 bottom
C22  41.1,4.8 0 top
C23  46.1,2.2 0 bottom
C24  55.63,7.65 180 top
CN1  19.35,2.1 0 top
D1  31.54,18.8 90 bottom
D2  47.89,21.73 180 bottom
D3  47.89,24.59 180 bottom
D4  49.14,14.1 90 bottom
D5  52.9,11.4 0 bottom
IC1  10.76,16.51 0 top
IC2  4.59,27.6 0 top
IC3  45.26,5.86 270 bottom
IC4  58.73,5.92 0 bottom
IC5  44.7,4.1 0 top
ICSP1  15.08,4.86 90 top
JETSON  GREEN  [0603']  9.44,25.89 0 top
JETSON1  RED  [0603']  9.45,24.57 0 top
JP2  64.49,13.68 90 bottom
M1  50.25,23.95 0 top
M2  47.05,23.95 0 top
M3  49.35,19.05 0 top
M4  45.9,19.05 0 top
M5  51.65,15.7 0 top
M6  48.5,15.15 0 top
Q1  60.4,11.89 270 top
Q2  60.41,8.54 270 top
R1  61.12,6.14 180 top
R2  17.4,22.49 90 bottom
R3  55.77,6.04 0 top
R4  53.71,26.45 0 top
R5  12.85,24.46 180 top
R6  53.71,23.43 0 top
R7  18.83,22.43 90 bottom
R8  33.73,19.68 270 bottom
R9  20.11,16.68 90 bottom
R10  12.85,25.86 180 top
R11  56.95,9.54 180 top
R12  17.73,5.06 90 bottom
R13  19.55,5.11 90 bottom
R14  63.78,8.11 0 top
R15  53.7,20.56 0 top
R16  47.33,9.46 180 bottom
R17  63.8,12.41 180 top
R18  57.22,12.59 180 top
R19  63.78,11.01 0 top
R20  63.75,9.61 180 top
R21  53.68,21.96 0 top
R22  29.78,19.58 270 bottom
R23  33.81,23.08 270 bottom
R24  48.42,9.7 0 top
R25  47.17,2.85 270 top
R26  53.68,19.14 0 top
R27  29.02,23.82 90 bottom
R28  53.7,24.95 0 top
R29  22.23,22.97 0 bottom
R30  52.85,12.74 0 top
R31  51.99,3.7 180 top
R32  52.79,10.43 90 top
R33  51.67,6.78 180 bottom
R34  51.67,4.86 180 bottom
R35  35.36,19.68 90 bottom
R36  53.9,26.75 180 bottom
R37  53.7,17.75 0 top
R38  53.4,20.25 180 bottom
R39  54.8,15.2 90 top
R40  57.6,12.05 180 bottom
R41  3.7,25.1 0 top
SPI-LED  6.35,5.7 0 top
ST  59.52,18.1 180 top
SW1  4.5,22.3 0 top
TH  59.52,15.56 180 top
U1  30.99,16.16 0 top
U$1  [MARK_POINT_3MM]  64.32,2.38 270 top
U$2  [MARK_POINT_3MM]  3.61,3.13 90 bottom
U$3  [MARK_POINT_3MM]  36.48,10.37 0 bottom
U$4  [LOGO_FABO_L_BOTTOM]  9.3,11.1 0 top
U$6  [MARK_POINT_3MM]  30.43,8.22 0 top
U$14  26.03,23.86 0 bottom
U$20  48.41,6.94 270 top
U$23  51.9,6.71 90 top
U$24  [LOGO_FABO_S]  30.75,1.85 0 top
X2  4.64,14.06 90 top

### Tracks (layer width: path | path; a pad name or v marks a point on that pad's centre or on a via)
3V3  (via drill 0.35)
  Top 0.152: 6.72,16.85 IC1.4 | 56.24,12.59 R18.2 56.37,13.12 56.85,13.6 58.5,13.6 58.8,13.9 59.9,13.9 60.35,13.45 v60.35,13.35 60.35,10.45 | 14.94,14.59 IC1.18 14.76,14.61 | 54.78,7.43 C24.2 | C24.2 54.78,8.68 55.64,9.54 R11.2 56.1,9.21 56.8,8.5 59.85,8.5 60.35,9 60.35,10.45 | v61.45,10.25 60.55,10.25 60.35,10.45 | v38.05,21.75 38.05,20.1 46.15,12 47.7,12 48.15,12.45 49.65,12.45 51.85,10.25 51.85,9.05 52.1,8.8 52.1,7.1 52.5,6.7 53.53,6.7 54.48,7.65 C24.2 | ICSP1.2 14.35,6.23 13.18,6.23 v12.75,6.65
  Top 0.305: 8.05,15.5 8.05,16.25 7.39,16.91 IC1.4 5.89,16.91 5.48,16.49 4.99,16.49 C3.2 4.24,17.24 C12.2 4,19.04 4,20.9 4.95,21.85 4.95,22.55 4.6,22.9 4.6,24.9 4.68,24.98 R41.2 4.3,25.35 4.3,27.32 IC2.1 | IC1.6 7.86,15.31 8.05,15.5 | 8.05,15.5 12.2,15.5 13.19,14.51 IC1.18 15.24,14.51 15.85,13.9 19.7,13.9 v20.2,14.4 | v8.3,14 8.3,15.25 8.05,15.5
  Bottom 0.152: 20.35,15.5 20.5,15.65 21.25,15.65 22.05,16.45 22.05,17.3 20.45,18.9 20.45,19.96 R7.1 18.83,21.9 R2.2 | 20.35,15.5 20.2,15.35 v20.2,14.4 20.2,11.65 | 20.2,11.65 20.6,11.25 25.1,11.25 25.99,12.14 25.99,12.15 | 25.99,12.15 U1.25 25.99,16.94 26.3,17.25 27.38,17.25 27.49,17.14 | 25.99,12.15 27,12.15 27.49,12.64 U1.22 27.49,17.14 | 19.99,15.72 R9.1 20.11,15.75 20.35,15.5 | 33.75,23.93 32.28,23.93 31.54,23.19 D1.CATHODE 30.3,21.95 29.68,21.33 29.68,20.43 | 33.75,23.93 R23.1 | 27.49,17.14 27.87,17.52 27.87,18.65 C6.2 | R22.1 29.68,20.43 | C6.2 C7.2 | C6.2 29.65,20.43 29.68,20.43 | 20.2,11.65 20.2,10.25 22.12,8.34 37.14,8.34 38.1,9.3 39.4,9.3 40.1,8.6 41.22,8.6 41.68,8.14 IC3.16 42.02,8.14 C20.2 | C2.2 63.69,6.57 62.88,7.37 IC4.28 62.88,9.92 62.55,10.25 v61.45,10.25 | IC2.17 26.2,28.85 | 26.2,28.85 | 26.2,28.85 26.2,27.65 26.8,27.05 32.8,27.05 33.75,26.1 33.75,23.93 | 24.73,27.37 26.2,28.85 | JP2.1 61.04,12.66 v60.35,13.35 | v38.05,21.75 38.05,22.75 36.85,23.95 36.85,25.2 37.6,25.95 37.6,29.65 37.05,30.2 27.55,30.2 26.2,28.85 | v8.3,14 8.3,10.8 9.1,10 11.5,10 12.3,9.2 12.3,7.1 v12.75,6.65
5V
  Top 0.508: IC2.2 5.85,31.4 2.1,31.4 1.1,30.4 1.1,12.7 5.35,8.45 SPI-LED.VCC
AVR_MISO  (via drill 0.35)
  Top 0.152: ICSP1.1 16.5,5.34 16.5,4.35 15.75,3.6 13.8,3.6 12.3,5.1 12.3,6 11.8,6.5 11.8,7.5 12.2,7.9 12.2,9.3 11.2,10.3 v11.2,10.9 | v12.6,14 13.56,13.03 IC1.16
  Bottom 0.152: v12.6,14 11.98,13.38 11.98,11.68 v11.2,10.9
AVR_MOSI  (via drill 0.35)
  Top 0.152: ICSP1.4 14.35,7.3 13.16,7.3 12.7,7.75 12.7,11.3 12.76,11.36 IC1.15 12.76,12.92 11.55,14.13 v11.18,14.13 | SPI-LED.DI 9.35,10.4 v9.85,10.9
  Bottom 0.152: v9.85,10.9 9.85,11 9.95,11.1 9.95,12.75 10.93,13.73 10.93,13.88 v11.18,14.13
AVR_RESET  (via drill 0.35)
  Top 0.152: ICSP1.5 17.12,8.67 17.75,9.3 17.75,11.8 v17.85,11.9 | v18.9,16.1 19.4,16.6 19.4,18.25 16.3,21.35 v15.55,21.35 14.36,22.55 10.87,22.55 10.36,22.04 IC1.29
  Bottom 0.152: v18.9,16.1 17.85,15.05 v17.85,11.9 | R2.1 15.84,21.64 v15.55,21.35
AVR_RX  (via drill 0.35)
  Top 0.152: IC1.30 9.55,20.6 9.55,19.15 9.1,18.7 9.1,17.7 v10.5,16.3
  Bottom 0.152: R12.2 17.73,9.23 17.45,9.5 17.45,10.35 16.3,11.5 15.6,11.5 13.56,13.55 13.56,13.99 12.49,15.06 11.74,15.06 v10.5,16.3
AVR_SCK
  Top 0.152: IC1.17 15.25,13.32 17.88,13.32 18.6,12.6 18.6,8.7 17.3,7.4 ICSP1.3 15.86,7.4 17.15,6.1 17.15,4.25 15.9,3 8.8,3 7.35,4.45 SPI-LED.CI
AVR_TX  (via drill 0.35)
  Top 0.152: v9.25,22.05 8.9,22.05 8.65,21.8 8.65,20.72 IC1.31
  Bottom 0.152: R13.2 18.6,6.92 18.6,10.14 16.84,11.9 16.6,11.9 11.2,17.3 11.2,17.64 9.55,19.29 9.55,21.75 v9.25,22.05
CH1  (via drill 0.35)
  Top 0.152: v19.6,24.5 17.15,24.5 v15.55,22.9 | v16.6,18.35 16.48,18.47 14.9,18.47 IC1.23 | v45.7,8.25 45.7,10.85 35.5,21.05 25.35,21.05 24.8,21.6 23.2,21.6 22.5,20.9 20.55,20.9 19.37,19.72 v19.03,19.72
  Bottom 0.152: R29.2 21.14,22.97 v19.6,24.5 | v15.55,22.9 14.8,22.15 14.8,20.65 16.8,18.65 | v16.6,18.35 16.6,18.45 16.8,18.65 | 48.44,7.59 IC3.2 47.82,7.49 47.1,8.2 47.1,8.4 47,8.5 46.4,8.5 46.05,8.15 45.8,8.15 v45.7,8.25 | v19.03,19.72 18.46,19.15 17.3,19.15 16.8,18.65
CH2  (via drill 0.35)
  Top 0.152: v48.3,2.55 47.72,2.55 R25.2 | v19.7,18.95 21.15,20.4 23,20.4 23.6,21 24.4,21 24.9,20.5 33.8,20.5 40.15,14.15 40.15,12.25 v44.8,7.6 | v13.4,17.95 13.4,18.3 14.41,19.31 IC1.24
  Bottom 0.152: IC3.5 47.17,5.54 46.7,6 | 46.7,6 46.7,4.15 v48.3,2.55 | v19.7,18.95 19.4,18.65 18.05,18.65 17.05,17.65 13.7,17.65 v13.4,17.95 | 46.7,6 45.1,7.6 v44.8,7.6
CH3  (via drill 0.35)
  Top 0.152: IC1.26 12.76,21.31 13.05,21.6 14.2,21.6 15.35,20.45 16.1,20.45 v16.7,19.85 | v18.35,20.35 19.15,21.15 19.15,22.05 19.9,22.8 38.4,22.8 44.4,16.8 44.4,14.75 46.26,12.9 49.81,12.9 51.55,11.15 52.66,11.15 R32.2
  Bottom 0.152: v18.35,20.35 17.85,19.85 v16.7,19.85
D3
  Top 0.152: 8.22,24.57 JETSON1.ANODE 7.4,23.32 7.4,20.05 IC1.1
D4
  Top 0.152: 6.26,18.51 IC1.2 5.88,18.51 5.68,18.71 5.68,24.33 6.74,25.39 8.14,25.39 JETSON.ANODE
GND  (via drill 0.35)
  Top 0.152: 6.51,15.96 IC1.5 3.09,16.11 2.56,16.64 C3.1 | 56.68,7.65 C24.1 54.92,6.09 R3.1 54.29,5.41 U$23.3 | R24.1 47.48,9.78 | 47.48,9.78 47.4,9.86 | U$20.3 47.5,8.19 | 2.51,17.22 C3.1 | 41.42,30.77 41.42,31.05 | 41.42,31.05 41.42,31.15 | 41.42,31.15 IC2.30 | 41.42,31.15 42.42,30.15 45.24,30.15 IC2.34 47.81,30.1 | M1.S 51.2,22.05 50.2,21.05 v48,21.05 | M3.S v49.5,18.7 | v30.85,12.95 30.8,13 v28.55,13 28.45,12.9 v26.7,12.9 24.65,12.9 v24.5,13.05 24.5,13.1 v23.55,14.05 22.76,14.85 v22.76,16.35 | 34.9,14.85 v34.9,12.85 35.14,12.85 40.59,7.39 | 13.7,25.45 R5.1 14.79,24.46 v14.95,24.3 15.65,25 v15.65,25.2 16.55,26.1 v16.55,26.95 v18.35,26.95 18.85,26.95 v19.55,26.25 19.55,26.9 20,27.35 | 13.7,25.45 R10.1 14.4,26.56 v14.4,27.3 | C1.1 16.18,16.91 IC1.21 13.15,16.91 | C3.1 2.54,17.24 C12.1 2.54,20.14 v2.65,20.25 | 13.7,25.45 16.02,27.77 IC2.9 17.3,30.15 19.84,30.15 IC2.14 22.41,30.1 27.43,30.1 28.72,31.39 | v5.59,17.73 5.61,17.71 IC1.3 7.8,17.7 8,17.5 v8.1,17.5 9.1,16.5 v9.3,16.5 | v46.65,19.1 46.7,19.05 46.7,18.05 M4.S | 54.02,28.97 52.89,30.1 47.81,30.1 | 54.02,28.97 IC2.39 54.15,28.9 55.35,28.9 55.43,28.98 | 41.42,31.05 40.52,30.15 37.4,30.15 36.34,29.09 IC2.25 35.06,30.15 29.95,30.15 28.72,31.39 | 28.72,31.39 IC2.20 | 24.68,9.43 v24.75,9.5 | v53.3,2.6 53.1,2.4 52.84,2.67 R31.1 52.84,5.4 U$23.3 | U$20.3 47.46,9.76 47.48,9.78 | v31.44,17.3 32.19,18.05 34.2,18.05 v34.5,17.75 | R1.1 62.8,6.14 | 62.8,6.14 62.92,6.14 v63.35,5.7 | M6.S 49.4,13.95 | 49.4,13.95 48.7,13.25 47,13.25 46.65,13.6 46.65,14.6 v46.95,14.9 | 49.4,13.95 49.88,13.95 50.04,13.79 52.34,13.79 52.6,14.05 M5.S | v44.8,19.4 43.7,20.5 v43.7,22.2 44.5,23 v44.8,23 45.5,23.7 46.95,23.7 v47.15,23.5 47.3,23.5 M2.S 48.85,23.65 48.85,26.25 47.81,27.3 47.81,30.1
  Top 0.152: v37.45,24.5 41.1,24.5 v41.2,24.6 | v40.82,7.47 40.74,7.54 40.59,7.39 | ICSP1.6 13.59,8.67 | v16.95,12.6 15.95,11.6 14,11.6 13.2,10.8 13.2,9.05 13.59,8.67 | v13.45,16.15 13.15,16.45 13.15,16.91 | v26.75,21.8 26.35,22.2 22.45,22.2 v21.95,21.7 20.25,21.7 v20.05,21.5 | 1.GND 62.06,31.79 61,32.85 56.85,32.85 56.2,32.2 | 54.62,28.97 54.02,28.97 | 55.43,28.98 56,29.55 56,31.2 | 56,31.2 56,32 56.2,32.2 | v25.25,14.55 26.6,14.55 v26.7,14.45 | v8.3,27 8.4,27.1 v11,27.1 | v19.95,27.35 20,27.35 | 20,27.35 22,27.35 v22.05,27.3 22.23,27.13 | 22.23,27.13 23.05,26.3 v23.15,26.3 23.9,27.05 | 23.9,27.05 v23.9,27.15 | v35.5,26.3 34.85,26.95 v34.2,26.95 32.55,26.95 v31.9,26.3 31.8,26.2 v29.6,26.2 v27.65,26.2 27.5,26.35 v25.8,26.35 24.9,26.35 v24.65,26.1 23.9,26.85 23.9,27.05 | v1.45,1.5 1.1,1.86 v1.1,3.31 v1.1,5.3 1.1,7.22 v1.13,7.25 2.14,8.26 v2.19,8.26 | v2.19,8.26 2.1,8.26 v1.1,9.25 1.25,9.25 v2.08,10.08 v1.06,11.1 | v2.19,8.26 3.35,7.1 3.35,7 | 3.35,7 SPI-LED.GND 4.26,6.06 v4.26,5.46 6.11,5.46 v6.18,5.52 v6.16,5.51 v6.16,4.02 6.16,2.19 v6.2,2.15 | v2.52,5.4 2.52,6.17 3.35,7 | v6.2,2.15 5.1,1.05 v4.7,1.05 | v6.2,2.15 7.35,1 v7.45,1 7.45,1.35 v8.35,2.25 v9.55,1.05 9.55,1.1 v10.55,2.1 10.6,2.1 v11.65,1.05 12.3,1.05 v12.95,1.7 13.4,1.7 v14.15,0.95 14.15,1.42 v14.87,2.13 | v8.75,5.5 9.95,4.3 v9.95,4.2 11.1,5.35 v11.1,5.55 | v11.1,5.55 12.05,4.6 v12.05,4.2 | v4,11.2 2.75,12.45 v2.75,12.55 2.75,13.75 2.93,13.93 v2.9,13.95 2.35,14.5 v2.35,15.3 | v4,32.4 3.75,32.15 v1.3,32.15 | 19.8,8.9 v19.75,8.85 21.15,7.45 v21.15,7.15 | 19.8,8.9 21,10.1 v21.5,10.1 22,9.6 v23.15,9.6 23.33,9.43 24.68,9.43
  Top 0.152: v19.35,12.65 19.35,9.35 19.8,8.9 | v24.75,9.5 26.3,9.5 v26.4,9.4 | v26.4,9.4 27.95,9.4 v28,9.35 | 26,7.2 v26,7.1 v27.85,7.1 | 26,7.2 26,9 v26.4,9.4 | v24.05,7.1 24.15,7.2 26,7.2 | 29.05,10.35 28.45,10.95 v27.5,10.95 26.2,10.95 v25.9,10.65 v24.75,9.5 | 29.05,10.35 v29.1,10.3 30.55,10.3 v30.6,10.35 32.5,10.35 | 32.5,10.35 v32.65,10.35 32.9,10.1 v32.9,9 | v32.9,9 32.9,7.6 v32.45,7.15 | v32.9,9 33,9.1 v34.15,9.1 34.15,7.2 | v34.1,7.15 34.15,7.2 | 34.15,7.2 v36.1,7.2 | v66.2,8.1 65.8,7.7 65.8,7.2 65.3,6.7 63.3,6.7 62.8,6.2 62.8,6.14 | v66.05,15.85 v66.05,17.7 v66.05,19.55 | v66.05,19.55 65.5,20.1 v64.45,20.1 63.29,21.27 3.GND | v66.05,19.55 v66.05,21.4 v66.05,23.25 | v64.25,22.4 65.1,23.25 v66.05,23.25 | v66.05,23.25 v66.05,25.1 | v66.05,25.1 66,25.05 v64.2,25.05 | v66.05,25.1 v66.05,26.9 v66.05,28.7 66.05,30.45 v66,30.5 v66,32.3 v64.3,32.3 v62.55,32.3 v62.55,30.5 v62.55,28.7 64.25,28.7 v64.3,28.65 v64.3,30.45 | v56.5,28.7 55.7,28.7 55.43,28.98 | v56.4,31.3 56.1,31.3 56,31.2 | v55.6,32.45 55.95,32.45 56.2,32.2 | v21.15,26.25 22.03,27.13 22.23,27.13 | v30.45,23.7 23.65,23.7 v23.05,24.3 | v10,13.75 9.4,14.35 v9.4,14.65 | 43.85,1.15 C10.1 | C10.1 44.7,2.25 IC5.2 | C22.1 40.25,7.05 40.59,7.39 | v41.35,1.25 41.5,1.4 C10.1 | v45.9,4.2 43.4,4.2 42.65,3.45 v42.65,2.1 43.35,1.4 C10.1 | U$20.3 47.6,8.09 47.6,7.4 50.1,7.4 50.1,8.8 v50.5,9.2 | v53.9,4.7 53.55,4.7 U$23.3 | SW1.2 6.55,23.6 v7.35,24.4 | SW1.1 1.8,23.75 1.8,26 2.35,26.55 v2.85,26.55 | v12.4,18.35 12.4,17.3 12.79,16.91 13.15,16.91 | 13.59,8.67 13.5,8.58 v13.5,8.1 | v11.1,5.55 v11.1,6.95 | v23.75,3.5 23.85,3.6 v25.7,3.6 27.9,3.6 v28,3.7 | v18.3,17.75 18.3,18.45 17.65,19.1 16.3,19.1 15.9,19.5 15.9,19.6 15.5,20 14.4,20 v14.3,20.1
  Top 0.152: v29.8,11.25 29.8,11.1 29.05,10.35 | v31.7,11.25 32.5,10.45 32.5,10.35 | v43.3,16.6 v42.3,17.6 | CN1.3 21.45,2.54 v21.45,5.05 21.45,6.2 24.68,9.43
  Top 0.254: X2.2 3.01,14.06 v2.9,13.95 | v6,11.15 6.95,12.1 v6.95,12.2 | v2.8,30.05 3.7,29.15 v3.9,29.15 3.8,29.15 v2.75,28.1 2.85,28 v2.85,26.55
  Top 0.305: v41.2,24.6 41.9,25.3 v42.5,25.3
  Bottom 0.152: R27.1 28.97,22.91 27.5,22.91 | U1.2 37.5,14.65 37.1,14.25 37.05,14.25 | U1.6 35.49,14.56 35.8,14.25 | 37.05,14.25 35.8,14.25 | U1.10 33.5,14.45 33.7,14.25 34,14.25 | 34,14.25 34.5,14.25 | 34.5,14.25 35,14.25 | 35,14.25 35.8,14.25 | U1.7 34.99,14.26 35,14.25 | 34.5,14.25 34.49,14.26 U1.8 v34.5,17.75 | U1.9 33.99,14.26 34,14.25 | C9.1 C8.1 38.4,20.48 | C9.1 36.7,20.48 | 36.7,20.48 35.42,20.48 R35.2 | C11.1 35.4,23.88 | 35.4,23.88 35.88,23.88 36.75,23 v36.75,21.9 36.77,21.88 C9.1 | 36.8,20.58 36.7,20.48 | C6.1 26.7,20.48 | 26.7,20.48 C7.1 | 30.6,14.65 31,14.65 | 30.6,14.65 30.49,14.76 U1.16 | U1.15 30.99,14.66 31,14.65 | 30.6,14.65 29.9,14.65 | 29.9,14.65 29.5,14.65 | 29.5,14.65 29,14.65 | 29,14.65 28.1,14.65 28,14.75 U1.21 | U1.18 29.5,14.65 | U1.19 29,14.65 | ST.GND 62.05,18.11 | U1.23 27,14.75 v26.7,14.45 26.65,14.4 26.65,13.15 26.7,13.1 v26.7,12.9 | 54.25,20.03 R38.2 54.25,18.25 53.3,17.3 51.4,17.3 50.98,17.73 50.48,17.73 v49.5,18.7 | v48,21.05 47.35,21.7 47.35,23.3 v47.15,23.5 | v49.5,18.7 49.48,18.68 49.23,18.68 48.15,17.6 48.15,16.1 v46.95,14.9 46.1,14.9 v45.9,14.7 45.4,15.2 v45.4,15.95 v46.7,15.95 | 49.4,18.7 v49.5,18.7 | v27.5,10.95 28.55,12 v28.55,13 | v30.6,10.35 30.85,10.6 v30.85,12.95 29.9,13.9 29.9,14.65 | v32.65,10.35 32.65,10.6 v34.9,12.85 35.45,12.85 | R40.2 59.4,12.05 60.2,11.25 60.2,8.92 IC4.24 60.28,7.93 59.3,6.95 59.3,6.7 60.1,5.9 60.1,4.15 60.28,3.97 IC4.5 | IC2.25 36.34,26 | 36.34,26 36.34,24.81 35.4,23.88 | SPI-LED.GND 3.35,13.5 v2.9,13.95 3.25,14.3 6.35,14.3 8.1,16.05 v8.1,17.5 v8.1,19.15 | v5.59,17.73 5.17,17.73 2.8,20.1 | 2.8,20.1 v2.65,20.25 | v49.5,18.7 47.05,18.7 v46.65,19.1 45.1,19.1 v44.8,19.4
  Bottom 0.152: C2.1 63.67,4.87 62.88,4.08 IC4.1 62.88,2.03 62.55,1.7 62.2,1.7 | U$14.3 27.5,22.91 | C6.1 27.8,20.67 | 27.5,22.91 27.8,22.61 27.8,22.35 v28.25,21.9 28.25,20.73 C6.1 | R36.2 54.75,28.24 IC2.39 | C20.1 44.98,8.93 43.54,7.49 43.3,7.49 | 43.3,7.49 IC3.15 40.84,7.49 v40.82,7.47 | R16.1 46.3,9.46 | 46.3,9.46 45.05,9.46 C20.1 | 54.43,2.48 IC4.14 | 54.43,2.48 53.85,1.9 59.95,1.9 | 54.43,2.48 54.45,2.5 53.4,2.5 v53.3,2.6 52.15,1.45 50.5,1.45 | v49.1,1.8 49.35,1.8 49.7,1.45 50.5,1.45 | 31,14.65 31.4,14.65 31.5,14.75 U1.14 31.49,17.25 v31.44,17.3 | 36.65,12.85 37.2,13.4 | 37.2,13.4 37.2,14.1 37.05,14.25 | 35.45,12.85 36.65,12.85 | 36.65,12.85 37,12.85 39.25,10.6 | 39.25,10.6 40.2,10.6 | 40.2,10.6 40.65,10.6 41.5,11.45 41.5,15.71 39.7,17.5 | 39.7,17.5 39.45,17.76 39.45,19.91 39.23,20.13 | 39.23,20.13 38.88,20.48 38.4,20.48 | v63.35,5.7 63.97,5.7 C2.1 | IC4.5 60.2,2.91 | 60.9,1.7 61.5,1.7 | 61.5,1.7 62.2,1.7 | IC4.3 61.58,1.78 61.5,1.7 | IC4.4 60.93,1.73 60.9,1.7 | IC4.2 62.23,1.73 62.2,1.7 | IC4.5 60.28,2.23 59.95,1.9 | 60.9,1.7 60.7,1.9 59.95,1.9 | v37.45,24.5 37.75,24.5 v39.75,22.5 39.75,21.83 38.4,20.48 | 43.65,22.25 41.3,24.6 v41.2,24.6 40.8,25 40.8,26.85 | 43.65,22.25 v43.7,22.2 | IC2.9 16.02,29.14 14.95,30.2 3.8,30.2 | v16.95,12.6 13.45,16.1 v13.45,16.15 | v26.75,21.8 26.75,20.53 26.7,20.48 | v20.05,21.5 20.05,21.3 21,20.35 21,19.05 22.7,17.35 22.7,16.41 v22.76,16.35 | v4.75,20.1 2.8,20.1 | v2.85,26.55 5,26.55 v5.2,26.35 5.5,26.35 v6.2,27.05 6.3,26.95 6.7,26.95 v7.35,26.3 | v7.35,26.3 8.05,27 v8.3,27 | v7.35,26.3 v7.35,24.4 7.35,23.85 | v35.5,26.3 36.04,26.3 36.34,26 | v39,26.85 40.8,26.85 | 40.8,26.85 v40.85,26.85 v42.1,26.85 42.15,26.9 v43.3,26.9 v44.6,26.9 45.8,26.9
  Bottom 0.152: 45.8,26.9 v45.9,26.9 v47.25,26.9 47.28,26.93 | 47.28,26.93 47.6,27.25 v48.9,27.25 50,27.25 v50.35,27.6 51.3,27.6 v51.75,27.15 | v9.95,4.2 10.55,3.6 v10.55,2.1 | v12.05,4.2 12.85,5 v13.75,5 13.75,5.85 14.1,6.2 14.1,7.5 v13.5,8.1 | v11.1,5.55 11.15,5.55 | v7.45,9.95 7.45,9.6 v8.34,8.72 6.77,8.72 v6.65,8.6 5.6,9.65 v5.6,9.75 6,10.15 v6,11.15 4.05,11.15 v4,11.2 | v4,32.4 4,30.4 3.8,30.2 | v36.1,7.2 36.15,7.25 v38.15,7.25 | v34.35,11.35 34.15,11.15 v34.15,9.1 | v36.25,13.65 35.45,12.85 | v37.9,13.3 37.3,13.3 37.2,13.4 | v38.85,10.35 39.1,10.6 39.25,10.6 | 40.2,10.6 40.2,9.8 v40.05,9.65 41.3,9.65 v41.85,9.1 | v42.4,13 42.45,12.95 v42.45,11.15 v44.25,11.15 44.98,10.42 C20.1 | v46.4,11 46.4,9.56 46.3,9.46 | v42.3,17.6 42.4,17.7 41.6,18.5 41.6,18.55 v41.5,18.65 41.6,18.65 42.35,19.4 v43.05,19.4 42.85,19.6 v42.85,20.85 | v42.85,20.85 41.85,20.85 v41.5,21.2 41.5,21.9 v42.05,22.45 | v42.85,20.85 42.85,21.45 43.65,22.25 | 23.85,3.6 v23.75,3.5 23.29,3.5 CN1.3 20.49,0.7 15.8,0.7 14.87,1.64 v14.87,2.13 | v27.15,2.35 25.35,2.35 v25.35,2.4 24.3,1.35 v24.3,1.1 | 34.3,2.35 34.4,2.35 v34.45,2.4 v36.25,2.4 37.3,1.35 v37.3,1.3 37.3,1.65 v38,2.35 38.05,2.35 v39.1,1.3 41.3,1.3 v41.35,1.25 | 34.3,2.35 v27.15,2.35 | 58.45,11.85 58.45,11.9 | 58.45,11.9 R40.2 | v45.2,25.9 45.2,26.3 45.8,26.9 | v48.1,26 48.1,26.1 47.28,26.93 | v62.15,1 62.15,1.65 62.2,1.7 | C2.1 64.84,4.87 v66,3.7 | v39.9,20.2 39.83,20.13 39.23,20.13 | v23.15,26.3 23.15,24.4 v23.05,24.3 v21.35,24.3 19.55,26.1 v19.55,26.25 | v9.4,14.65 9.4,16.4 v9.3,16.5 | v39.6,15.65 38.85,16.4 v38.85,16.65 39.7,17.5 | 43.3,7.49 v43.3,7.5 | v45.9,4.2 45.9,3.25 C23.1 47.35,1.8 v49.1,1.8
  Bottom 0.152: v56.1,10.75 v58,10.75 58,11.45 58.45,11.9 | R40.2 58.45,12.65 58.1,13 56,13 55.3,13.7 54.4,13.7 54.2,13.5 54.2,12.76 53.23,11.79 53.23,11.13 52.9,10.8 52.9,10.3 51.8,9.2 v50.5,9.2 | v50.5,2.1 50.5,1.45 | IC3.8 49.22,3.59 49.5,3.3 v49.5,2.8 49.5,2.2 v49.1,1.8 | v58,4.7 v53.9,4.7 | v37.3,3.7 v35.5,3.7 v33.5,3.7 33.4,3.8 v30.3,3.8 30.2,3.7 v28,3.7 28,3.2 v27.15,2.35 | v31.2,1 32.6,1 v33.1,1.5 33.45,1.5 34.3,2.35 | v17.55,26.15 v18.35,26.95 | v14.3,20.1 14.2,20.2 14.2,23.55 v14.95,24.3 | v2.8,30.05 2.95,30.2 3.8,30.2
  Bottom 1.27: TH.GND ST.GND 3.GND 2.GND 1.GND
  pour Top (rank 6): -5.8,41.45 75.1,41.45 75.1,-4.65 -5.8,-4.65
  pour Bottom (rank 6): -6.4,41.95 74.35,41.95 74.35,-6.7 -6.4,-6.7
J_CH1
  Bottom 0.152: IC3.3 50.77,6.84 R33.1
J_CH2
  Bottom 0.152: IC3.6 50.79,4.89 R34.1
N$2  (via drill 0.35)
  Top 0.152: 52.48,25.32 R28.1 52.5,25.3 v51.55,25.3 | v50.1,26.2 49.51,25.61 49.51,24.79 49.3,24.58 M1.G
  Bottom 0.152: v50.1,26.2 51.8,26.2 | 51.8,26.2 52.1,26.2 52.65,26.75 R36.1 | v51.55,25.3 51.55,25.95 51.8,26.2
N$3
  Top 0.152: 61.68,11.89 Q1.D 62.07,12.41 R17.2 62.93,12.39 R19.1 62.6,11.34
N$4
  Top 0.152: IC1.20 14.88,16.1 15.29,16.1 C1.2 15.92,15.47
N$5
  Top 0.152: X2.3 4.73,12.95 | 6.33,13.57 6.55,13.57 6.69,13.71 IC1.8
  Top 0.254: X2.3 6.06,12.86 6.69,13.49 6.69,13.71
N$6
  Bottom 0.152: CN1.1 16.81,3.3 R12.1
N$7  (via drill 0.35)
  Top 0.152: IC1.19 13.29,15.31 11,17.6 v10.1,17.6 | SW1.3 6.4,21.35 v6.4,20.2 | v3.8,22.2 3.8,24.15 R41.1
  Top 0.305: SW1.4 2.65,21.7 3.3,21.7 v3.8,22.2
  Bottom 0.152: v10.1,17.6 8.8,18.9 8.8,20.1 8.5,20.4 7,20.4 6.8,20.2 v6.4,20.2 6.2,20.2 4.2,22.2 v3.8,22.2
N$8  (via drill 0.35)
  Top 0.152: R1.2 60.55,6.42 v60.55,7.3
  Bottom 0.152: v60.55,7.3 60.93,7.68 IC4.25
N$9
  Top 0.152: R14.1 61.99,8.11 Q2.D 61.56,9.36 61.81,9.61 R20.2
N$10
  Top 0.152: R17.1 | R17.1 65.05,12.01 | ST.I/O 58.59,19.7 63.55,19.7 64.66,18.6 R17.1
N$11
  Top 0.152: M2.G 47,21.9 49.7,21.9 50.25,22.45 M1.D 51.6,26.45 R4.1
N$12  (via drill 0.35)
  Top 0.152: R6.1 52.73,23.43 52.66,23.5 52,23.5 v51.35,24.15 | M2.D 47.25,25.1 v48.15,24.2
  Bottom 0.152: v51.35,24.15 50.91,24.59 D3.2 48.54,24.59 v48.15,24.2
N$13  (via drill 0.35)
  Top 0.152: v55.7,19.4 55.7,18.2 55.25,17.75 R37.2
  Bottom 0.152: 2.I/O 56.41,23.81 55.55,22.95 55.55,19.4 v55.7,19.4
N$14  (via drill 0.35)
  Top 0.152: R20.1 65.04,9.61 | R20.1 64.91,9.3 | R20.1 65.89,9.61 v65.95,9.55
  Bottom 0.152: v65.95,9.55 65.95,10.7 65.6,11.05 60.9,11.05 60.15,11.8 60.15,12.55 57.15,15.56 TH.I/O
N$15
  Top 0.152: 6.6,14.57 IC1.7 | 5.3,15.26 X2.1
  Top 0.254: X2.1 5.35,15.26 6.03,14.57 6.6,14.57
N$16
  Bottom 0.152: U1.27 24.99,17.26 24.3,17.95 24.3,19.55 25.23,20.48 C4.2
N$17
  Bottom 0.152: CN1.2 19.35,4.06 R13.1
N$18
  Top 0.152: 52.89,20.56 R15.1 | R15.1 52.85,20.4 | R15.1 52.64,20.35 49.5,20.35 M3.D 49.2,20.05 48.4,20.05 47.65,19.3 47.65,17.3 47.33,16.98 45.23,16.98 44.95,17.25 M4.G
N$19
  Top 0.152: R5.2 10.36,24.46 JETSON1.CATHODE
N$20
  Top 0.152: R10.2 11.98,25.89 JETSON.CATHODE
N$21
  Bottom 0.152: U1.26 25.49,18.53 C4.1
N$22
  Bottom 0.152: C5.1 22.87,20.28 23.75,19.4 23.75,17.9 24.49,17.16 U1.28
N$23
  Bottom 0.152: 22.87,18.28 C5.2 23,18.65 23,17.75 23.2,17.55 23.5,17.55 23.99,17.06 U1.29
N$24
  Bottom 0.152: U1.5 35.99,17.06 35.36,17.69 R35.1
N$25
  Bottom 0.152: U1.4 36.49,17.74 36.77,18.02 C9.2
N$26
  Bottom 0.152: U1.3 36.99,17.14 37.1,17.25 37.9,17.25 38.35,17.7 C8.2
N$27
  Bottom 0.152: U1.17 29.99,17.04 30.85,17.9 32.85,17.9 33.73,18.78 R8.2
N$28
  Bottom 0.152: 31.57,18.78 D1.ANODE 32.5,19.76 32.5,20.25 32.8,20.55 33.73,20.55 | C11.2 35.27,22.23 33.9,22.23 | 33.9,22.23 R23.2 | R8.1 33.73,20.55 | 33.73,20.55 33.73,22.06 33.9,22.23
N$29  (via drill 0.35)
  Top 0.152: R21.1 52.72,21.85 52.03,21.85 51.54,21.36 v51.54,21.16 | v47,20.1 46,20.1 M4.D
  Bottom 0.152: v51.54,21.16 50.97,21.73 D2.2 48.13,20.25 47.15,20.25 v47,20.1
N$30  (via drill 0.35)
  Top 0.152: U$20.2 48.41,8.84 R24.2 50.35,10.78 50.35,11.1 49.4,12.05 48.7,12.05 48.15,11.5 v48.15,11.2
  Bottom 0.152: D2.1 45.18,21.73 44,20.55 44,15.7 48.15,11.55 v48.15,11.2
N$31
  Top 0.152: U$20.4 47.46,3.99 R25.1
N$32  (via drill 0.35)
  Top 0.152: R39.2 55.65,16.9 v55.8,16.9
  Bottom 0.152: 3.I/O 56.98,20.77 58.25,19.5 58.25,17.35 57.8,16.9 v55.8,16.9
N$33
  Top 0.152: R26.1 52.73,19.24 51.59,19.24 51,18.65 51,17.4 51.55,16.85 M5.D 50.1,15.3 48.85,15.3 M6.G
N$34  (via drill 0.35)
  Top 0.152: v31.75,24.65 32.9,24.65 33.9,23.65 43.55,23.65 v44.3,24.4
  Bottom 0.152: 46.17,24.24 46.17,24.5 | 46.17,24.5 D3.1 | U$14.2 28.22,23.86 R27.2 31.74,24.67 v31.75,24.65 | v44.3,24.4 46.07,24.4 46.17,24.5
N$35
  Bottom 0.152: R29.1 23.13,22.91 U$14.4
N$36  (via drill 0.35)
  Top 0.152: M6.D 49.02,16.82 v50.15,16.82 | R30.1 50.92,12.74 v50.65,13
  Bottom 0.152: v50.15,16.82 D4.2 49.14,14.11 50.25,13 v50.65,13
N$37  (via drill 0.35)
  Top 0.152: R31.2 51.14,3.89 51.9,4.65 U$23.2 51.7,5.6 51.7,6.87 51.6,6.98 51.6,8.76 51.35,9 51.35,9.8 v50.95,10.2
  Bottom 0.152: D4.1 50.25,11.27 50.25,10.9 v50.95,10.2
N$38
  Top 0.152: U$23.4 52.79,8.07 R32.1
N$39
  Top 0.152: 57.84,9.49 R11.1 59.22,9.54 Q2.G
N$40
  Top 0.152: R18.1 58.99,12.59 Q1.G
N$41  (via drill 0.35)
  Top 0.152: R14.2 64.44,8.11 63.75,8.8 63.75,10.44 64.33,11.01 R19.2 65.26,11.01 v65.95,11.7
  Bottom 0.152: JP2.2 65.83,13.68 65.95,13.55 v65.95,11.7
N$42
  Bottom 0.152: R33.2 53.42,5.88 57.87,5.88 59.63,4.12 IC4.6
N$43
  Bottom 0.152: IC4.7 59,3.01 59,3.85 58.8,4.06 54.16,4.06 53.8,3.7 53,3.7 52.52,4.18 R34.2
N$44
  Top 0.152: R28.2 55.6,24.95 1.I/O
N$45  (via drill 0.35)
  Top 0.152: R37.1 52.35,18.26 v51.7,18.26 | M3.G 48.4,18.9 48.85,19.35 v50.5,19.35
  Bottom 0.152: R38.1 52.38,20.08 | 52.38,20.08 52.3,20 | v51.7,18.26 51.5,18.45 51.5,19.45 51.58,19.53 | 51.58,19.53 52.13,20.08 52.38,20.08 | v50.5,19.35 50.68,19.53 51.58,19.53
N$46  (via drill 0.35)
  Top 0.152: M5.G 50.75,14.55 51.55,15.35 53.8,15.35 R39.1 54.8,12.9 v55.05,12.65
  Bottom 0.152: R40.1 56.6,11.9 55.7,11.9 55.05,12.55 v55.05,12.65
N$47  (via drill 0.35)
  Top 0.152: v44.7,4.9 44.7,5.1 45,5.4 IC5.4
  Bottom 0.152: C23.2 44.5,2.95 44.5,4.7 v44.7,4.9
N$48  (via drill 0.35)
  Top 0.152: IC5.1 43.75,3.55 44,3.8 45.3,3.8 45.65,3.45 IC5.3 45.55,2.7 C10.2 46,1.4 46.4,1 57.98,1 58.69,1.71 | 58.69,1.71 58.71,1.73 | 58.69,1.71 58.69,1.79 59.5,2.6 59.5,4.5 59,5 59,6 v58.9,6.1
  Bottom 0.152: v58.9,6.1 58.5,6.5 57.8,6.5 57.5,6.8 54.1,6.8 53.7,7.2 53.7,9.21 54.31,9.82 54.72,9.82 55.2,10.3 55.2,11.1 54.9,11.4 D5.1
N$50
  Bottom 0.152: R22.2 29.78,18.03 29.1,17.35 28.7,17.35 28.49,17.14 U1.20
OE_PIN  (via drill 0.35)
  Top 0.152: v57.85,7.4 57.05,6.6 57.05,6 56.9,5.85 56.81,5.85 R3.2 56.62,5.42 55.2,4 55.2,2.4 54.8,2 52.9,2 52.1,2.8 50.4,2.8 48.5,4.7 48.5,6.2 48.11,6.6 45.2,6.6 v44.7,6.1 | IC1.22 17.39,17.71 17.8,17.3 17.8,15.9 18.8,14.9 v19,14.9
  Bottom 0.152: v57.85,7.4 58.2,7.75 59.4,7.75 59.6,7.95 59.6,8.81 IC4.23 59.63,9.67 59.11,10.2 55.87,10.2 55.55,10.52 55.55,10.98 55.87,11.31 57.41,11.31 57.5,11.4 | v44.7,6.1 44.3,6.1 43.6,5.4 43.6,3.5 43.08,2.98 41.23,2.98 40.7,3.5 40.7,6.6 40.1,7.2 40.1,7.83 39.33,8.6 38.3,8.6 37.5,7.8 21.6,7.8 19.8,9.6 19.8,11.1 18.6,12.3 18.6,14.5 v19,14.9
RC_3V3  (via drill 0.35)
  Top 0.152: IC5.5 43.15,4.8 C22.2 | IC5.5 43.75,6.2 44.45,6.9 49.1,6.9 49.36,6.65 U$20.5 50.1,6.38 50.1,6.4 50.95,7.25 U$23.5 | IC5.5 42.1,7.05 42.1,7.8 40.9,9 40.9,10.3 38.8,12.4 38.8,13.8 35.3,17.3 35.3,17.9 33.8,19.4 24.4,19.4 | 24.4,19.4 24.3,19.4 | 24.4,19.4 24,19.8 v24,20.1
  Bottom 0.152: v24,20.1 24,21.5 24.4,21.9 25.5,21.9 26.1,22.5 26.1,24.1 25.39,24.81 U$14.5
RCH1  (via drill 0.35)
  Top 0.152: v46.55,7.6 46.7,7.75 46.7,8.9 46.6,9 46.6,10.25 47,10.65 47.92,10.65 49.05,10.65 v49.4,11 | v53.85,10.4 54.9,11.45 58.74,11.45 Q1.S
  Bottom 0.152: v46.55,7.6 46.55,7.05 47.42,6.19 IC3.4 | v53.85,10.4 53.85,10 52.1,8.25 50.15,8.25 49.4,9 v49.4,11
RCH2  (via drill 0.35)
  Top 0.152: v51.7,2.15 52.28,1.58 56.18,1.58 56.8,2.2 56.8,4.49 57.7,5.39 57.7,6.23 59.06,7.59 Q2.S
  Bottom 0.152: v51.7,2.15 51.7,2.2 49.67,4.24 IC3.7
SCL  (via drill 0.35)
  Top 0.152: v21.65,19.45 23.9,17.2 23.9,14.95 25.1,13.75 31.3,13.75 v31.5,13.95 | IC1.28 11.16,19.54 11.5,19.2 v13.15,19.2 | v61,4.8 61,2.8 59.4,1.2 v59.15,1.2 | v39.17,7.62 33.75,13.04 33.75,16.9 v33.29,17.36
  Bottom 0.152: v21.65,19.45 21.8,19.6 21.8,20.76 19.28,23.28 R7.2 18.83,24.67 18.5,25 17.5,25 16.15,26.35 13.45,26.35 | v31.5,13.95 31.5,14.05 32,14.55 U1.13 31.99,17.14 32.21,17.36 v33.29,17.36 | v13.15,19.2 13.45,19.5 13.45,26.35 | 13.45,26.35 13.45,26.36 IC2.5 | IC4.26 61.58,5.33 61.05,4.8 v61,4.8 | v59.15,1.2 58.95,1 42.61,1 41.5,2.1 41,2.1 39.9,3.2 39.9,6.19 39.17,6.92 v39.17,7.62
SDA  (via drill 0.35)
  Top 0.152: 12.03,20.54 IC1.27 | v21.2,16.75 21.65,16.3 21.65,14.05 23.6,12.1 31.95,12.1 v32.7,12.85 32.7,11.65 37.95,6.4 39,6.4 39.3,6.1 39.3,2.05 40.9,0.45 60.35,0.45 62.35,2.45 v62.35,4.8 | IC1.27 11.81,20.76 | IC1.27 11.96,21.32 v11.51,21.78
  Bottom 0.152: v21.2,16.75 20.89,16.75 R9.2 19.53,16.95 12.75,16.95 10.48,19.23 10.48,21.53 10.73,21.78 v11.51,21.78 11.75,22.02 11.75,24.9 8.4,28.26 IC2.3 | v32.7,12.85 32.7,14.65 | U1.12 32.49,14.86 32.7,14.65 | U1.11 32.99,14.94 32.7,14.65 | IC4.27 62.25,8.82 62.25,4.9 v62.35,4.8
SEL  (via drill 0.35)
  Top 0.152: v38.75,25.3 17,25.3 14.94,23.24 8.99,23.24 7.96,22.21 IC1.32
  Bottom 0.152: IC3.1 48.18,8.5 R16.2 48.18,10.31 40.65,17.84 40.65,23.4 v38.75,25.3
VCC_RC  (via drill 0.35)
  Top 0.152: 54.86,26.25 54.83,26.22 54.83,26.63 56,27.8 58,27.8 59.46,26.35 1.VCC | R6.2 54.53,23.4 R21.2 54.55,21.94 R15.2 54.53,20.54 R26.2 54.63,19.04 | R6.2 54.71,23.58 | 54.86,26.25 54.76,26.25 R4.2 | 54.86,26.25 55.16,26.55 | 2.VCC 58.22,22.5 55.98,22.5 55.06,23.43 R6.2 | v53.6,14.4 53.7,14.3 R30.2 | v56,14.05 58.02,14.05 TH.VCC
  Bottom 0.152: v56,14.05 55.7,14.05 55.35,14.4 v53.6,14.4 53.6,13.82 D5.2 | JP2.3 63.44,14.69 62.7,13.95 61.13,13.95 TH.VCC
  Bottom 1.27: 1.VCC 2.VCC 3.VCC ST.VCC TH.VCC

### Text on the board
tPlace: REV 2.0.14 | RC | JS | RX | TX | G | Designed in Aizu | #612
bPlace: S/N | F-612-2-14-A-N-J-0-P | RC | 3v3
Document: Y | X | O | #612 JetRacer Rev2.0.14
tDocu: OLED AREA | TX | GND | RX